# EasyEDA Pro project 4040M主控板V1.0.eprj

# Schematic 原理图
Board Name: ESP32s3; Create Date: 2025-05-14; Page Name: 电源; Project Name: 4040M主控板V1.0; Schematic Name: 原理图; Update Date: 2026-04-21; Company: 嘉立创EDA; Page Size: A3; Version: V1.0
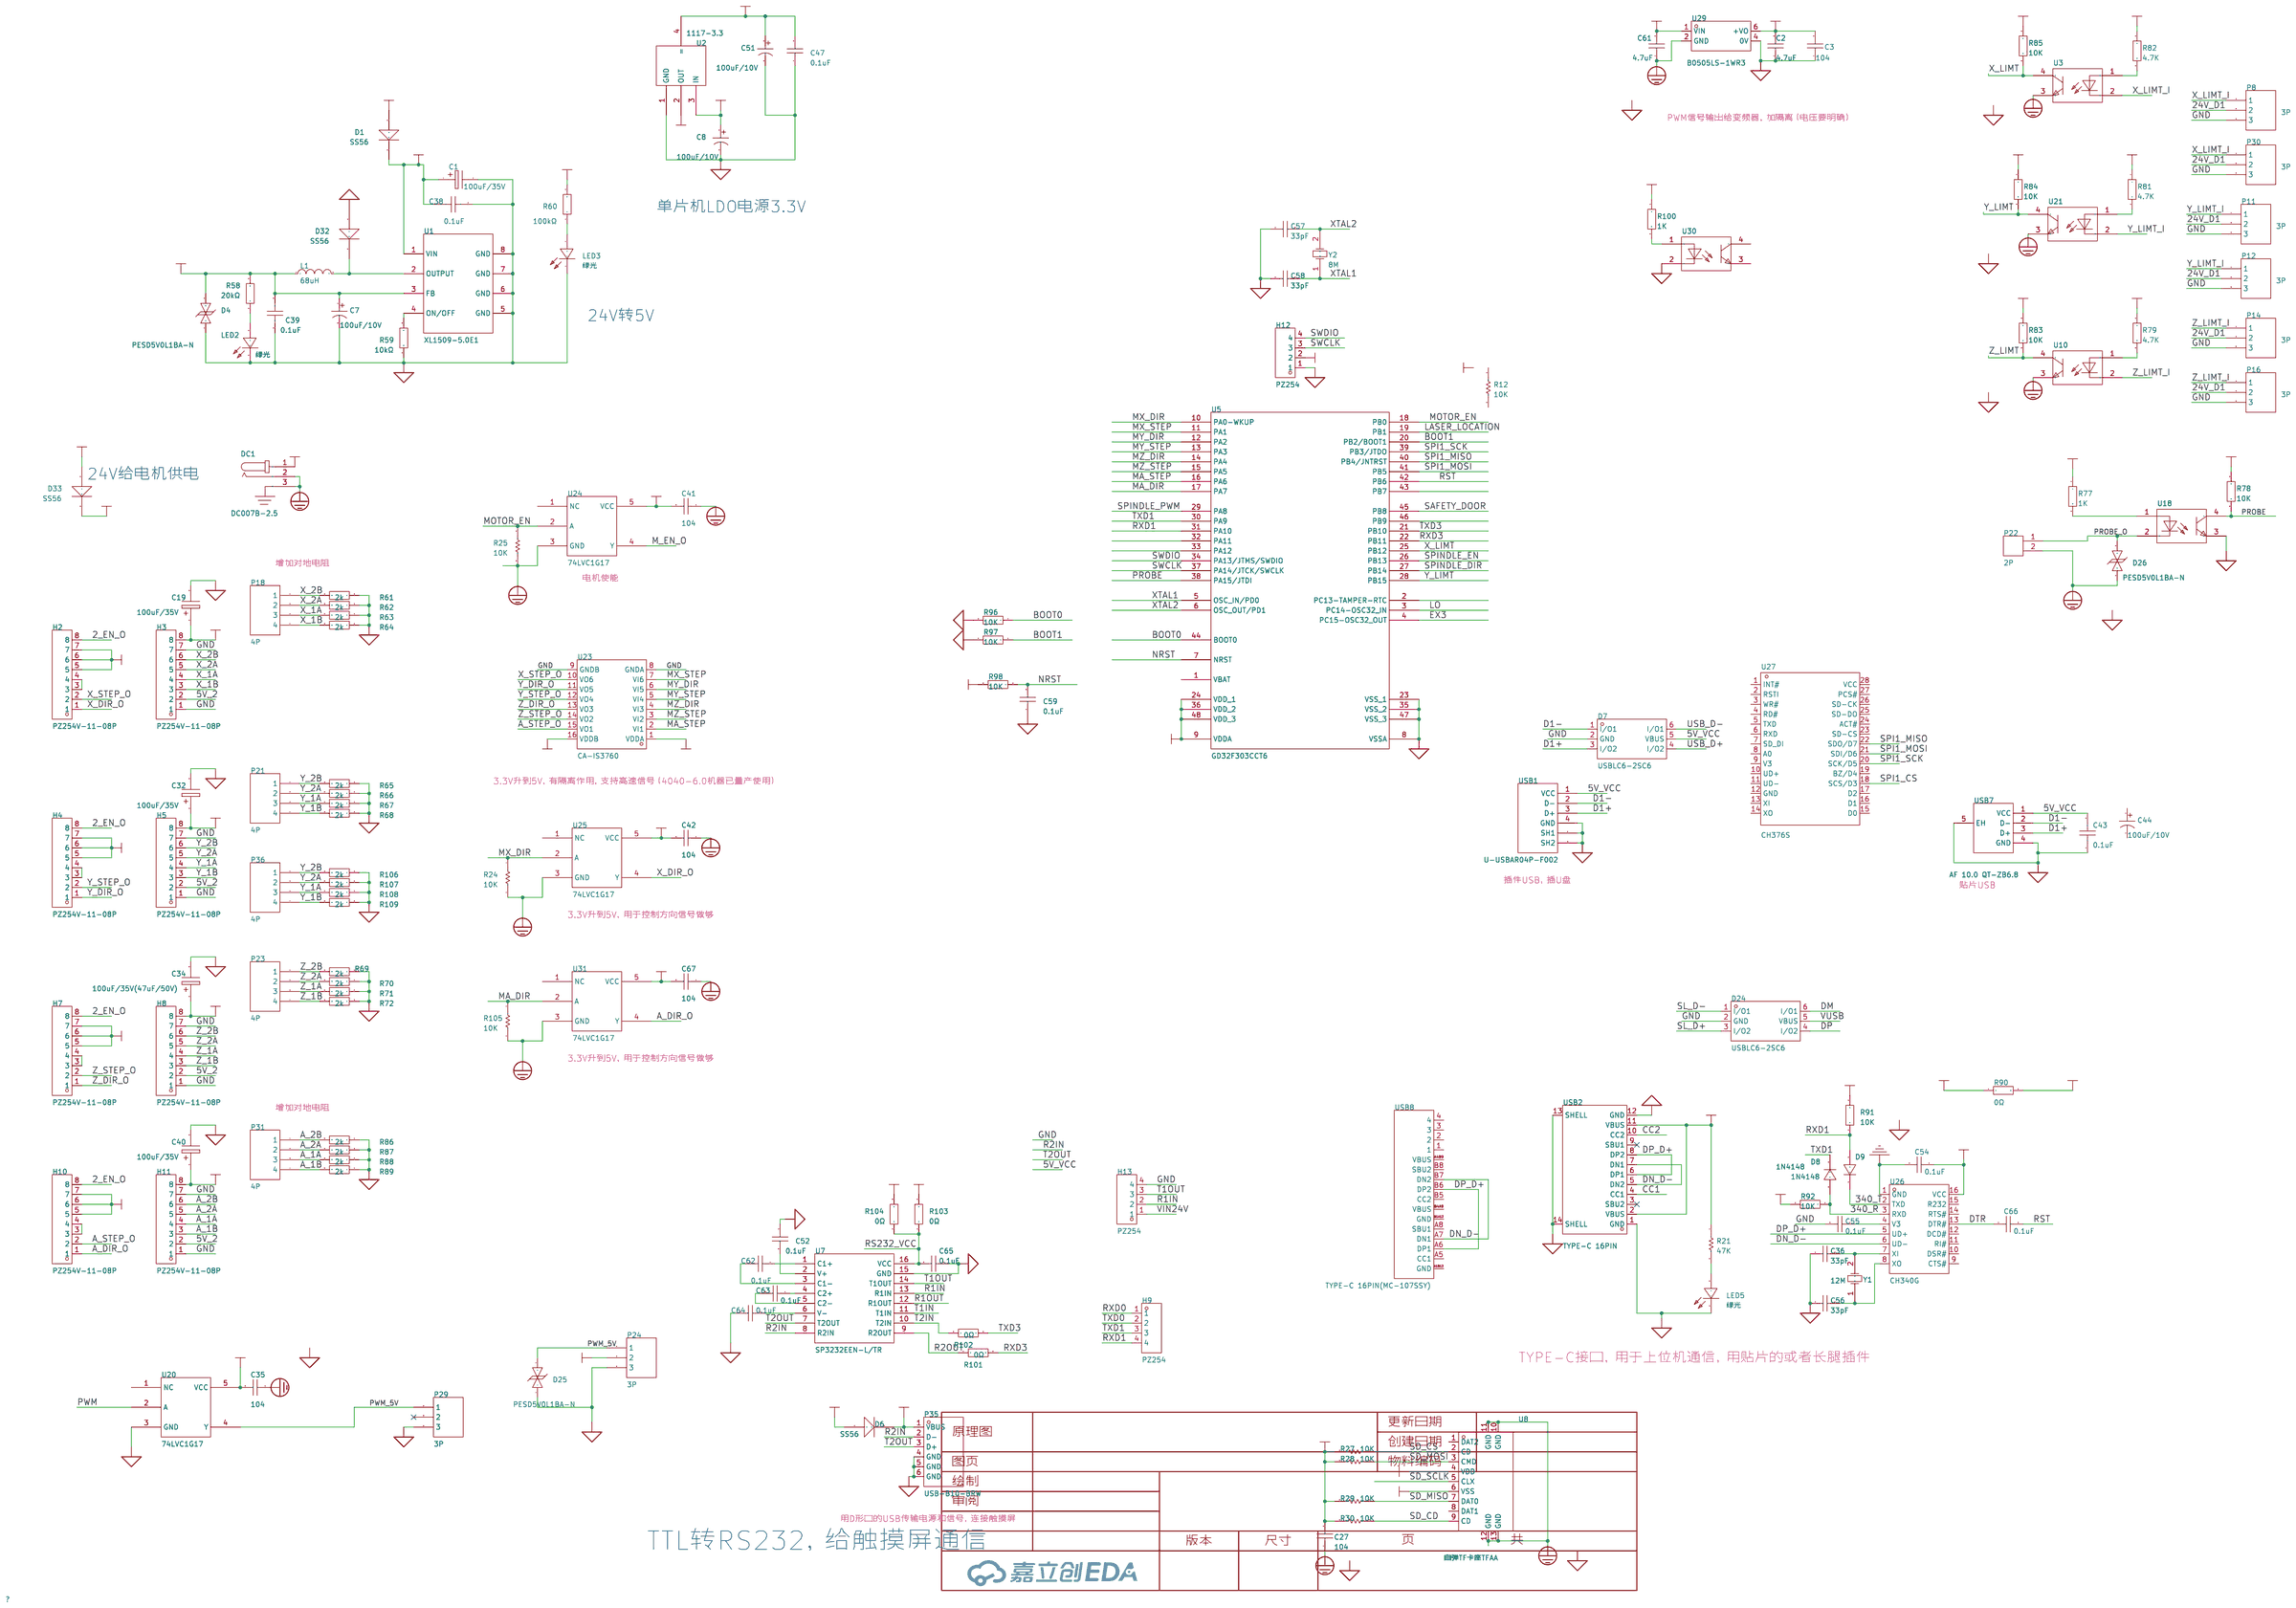
[diagram p0: schematic sheet]

## Parts
C1  100uF/35V  [电解电容贴片6X6]
C2  4.7uF  [C1206]
C3  104  [C0603]
C7  100uF/10V  [CAP-SMD_BD5.0-L5.3-W5.3-RD]
C8  100uF/10V  [CAP-SMD_BD5.0-L5.3-W5.3-RD]
C19  100uF/35V  [电解电容贴片6X6]
C27  104  [11]
C32  100uF/35V  [电解电容贴片6X6]
C34  100uF/35V(47uF/50V)  [电解电容贴片6X6]
C35  104  [0603C]
C36  33pF  [C0603]
C38  0.1uF  [C0603]
C39  0.1uF  [C0603]
C40  100uF/35V  [电解电容贴片6X6]
C41  104  [0603C]
C42  104  [0603C]
C43  0.1uF  [C0603]
C44  100uF/10V  [CAP-SMD_BD5.0-L5.3-W5.3-RD]
C47  0.1uF  [C0603]
C51  100uF/10V  [CAP-SMD_BD5.0-L5.3-W5.3-RD]
C52  0.1uF  [C0603]
C54  0.1uF  [C0603]
C55  0.1uF  [C0603]
C56  33pF  [C0603]
C57  33pF  [C0603]
C58  33pF  [C0603]
C59  0.1uF  [C0603]
C61  4.7uF  [C1206]
C62  0.1uF  [C0603]
C63  0.1uF  [C0603]
C64  0.1uF  [C0603]
C65  0.1uF  [C0603]
C66  0.1uF  [C0603]
C67  104  [0603C]
D1  SS56  [SMA]
D4  PESD5V0L1BA-N  [SOD-323_L1.8-W1.3-LS2.5-BI]
D6  SS56  [SMA]
D7  USBLC6-2SC6  [SOT-23-6_L2.9-W1.6-P0.95-LS2.8-BL]
D8  1N4148  [SOD-323_L1.8-W1.3-LS2.5-RD]
D9  1N4148  [SOD-323_L1.8-W1.3-LS2.5-RD]
D24  USBLC6-2SC6  [SOT-23-6_L2.9-W1.6-P0.95-LS2.8-BL]
D25  PESD5V0L1BA-N  [SOD-323_L1.8-W1.3-LS2.5-BI]
D26  PESD5V0L1BA-N  [SOD-323_L1.8-W1.3-LS2.5-BI]
D32  SS56  [SMA]
D33  SS56  [SMA]
DC1  DC007B-2.5  [DC-IN-TH_HX-DC007B-2.5]
H2  PZ254V-11-08P  [HDR-TH_8P-P2.54-V-M]
H3  PZ254V-11-08P  [HDR-TH_8P-P2.54-V-M]
H4  PZ254V-11-08P  [HDR-TH_8P-P2.54-V-M]
H5  PZ254V-11-08P  [HDR-TH_8P-P2.54-V-M]
H7  PZ254V-11-08P  [HDR-TH_8P-P2.54-V-M]
H8  PZ254V-11-08P  [HDR-TH_8P-P2.54-V-M]
H9  PZ254  [HDR-TH_4P-P2.54-V-M]
H10  PZ254V-11-08P  [HDR-TH_8P-P2.54-V-M]
H11  PZ254V-11-08P  [HDR-TH_8P-P2.54-V-M]
H12  PZ254  [HDR-TH_4P-P2.54-V-M]
H13  PZ254  [HDR-TH_4P-P2.54-V-M]
L1  68uH  [IND-SMD_L7.0-W7.0_SMDRI74-330MT]
LED2  绿光  [LED0603-RD]
LED3  绿光  [LED0603-RD]
LED5  绿光  [LED0603-RD]
P8  3P  [HDR1X3_CON]
P11  3P  [HDR1X3_CON]
P12  3P  [HDR1X3_CON]
P14  3P  [HDR1X3_CON]
P16  3P  [HDR1X3_CON]
P18  4P  [HDR1X4_CON]
P21  4P  [HDR1X4_CON]
P22  2P  [HDR1X2_CON]
P23  4P  [HDR1X4_CON]
P24  3P  [HDR1X3_CON]
P29  3P  [HDR1X3_CON]
P30  3P  [HDR1X3_CON]
P31  4P  [HDR1X4_CON]
P35  USB-B10-BRW  [USB-B-TH_USB-B10-BRW]
P36  4P  [HDR1X4_CON]
R12  10K  [0603R]
R21  47K  [10]
R24  10K  [0603R]
R25  10K  [0603R]
R27  10K  [10]
R28  10K  [10]
R29  10K  [10]
R30  10K  [10]
R58  20kΩ  [R0603]
R59  10kΩ  [R0603]
R60  100kΩ  [R0603]
R61  2k  [R0603]
R62  2k  [R0603]
R63  2k  [R0603]
R64  2k  [R0603]
R65  2k  [R0603]
R66  2k  [R0603]
R67  2k  [R0603]
R68  2k  [R0603]
R69  2k  [R0603]
R70  2k  [R0603]
R71  2k  [R0603]
R72  2k  [R0603]
R77  1K  [R0603]
R78  10K  [R0603]
R79  4.7K  [R0603]
R81  4.7K  [R0603]
R82  4.7K  [R0603]
R83  47K  [R0603]
R84  47K  [R0603]
R85  47K  [R0603]
R86  2k  [R0603]
R87  2k  [R0603]
R88  2k  [R0603]
R89  2k  [R0603]
R90  0Ω  [R0603]
R91  10K  [R0603]
R92  10K  [R0603]
R96  10K  [R0603]
R97  10K  [R0603]
R98  10K  [R0603]
R100  47K  [R0603]
R101  0Ω  [R0603]
R102  0Ω  [R0603]
R103  0Ω  [R0603]
R104  0Ω  [R0603]
R105  10K  [0603R]
R106  2k  [R0603]
R107  2k  [R0603]
R108  2k  [R0603]
R109  2k  [R0603]
U1  XL1509-5.0E1  [ESOP-8_L4.9-W3.9-P1.27-LS6.0-BL-EP]
U2  1117-3.3  [SOT-223]
U3  LTV-357T-C  [SOP-4_L4.4-W3.9-P2.54-LS7.0-TL]
U5  GD32F303CCT6  [LQFP48]
U7  SP3232EEN-L/TR  [SOIC-16_L9.9-W3.9-P1.27-LS6.0-BL]
U8  自弹TF卡座TFAA  [SIM-SMD_C9900015645]
U10  LTV-357T-C  [SOP-4_L4.4-W3.9-P2.54-LS7.0-TL]
U18  LTV-357T-C  [SOP-4_L4.4-W3.9-P2.54-LS7.0-TL]
U20  74LVC1G17  [SOT-23-5]
U21  LTV-357T-C  [SOP-4_L4.4-W3.9-P2.54-LS7.0-TL]
U23  CA-IS3760  [SOIC-16_L9.9-W3.9-P1.27-LS6.0-BL]
U24  74LVC1G17  [SOT-23-5]
U25  74LVC1G17  [SOT-23-5]
U26  CH340G  [SOIC-16_L9.9-W3.9-P1.27-LS6.0-BL]
U27  CH376S  [SOIC-28_L17.9-W7.5-P1.27-LS10.3-BL]
U29  B0505LS-1WR3  [PWRM-TH_BXXXXLS-1WR3]
U30  LTV-357T-C  [SOP-4_L4.4-W3.9-P2.54-LS7.0-TL]
U31  74LVC1G17  [SOT-23-5]
USB1  U-USBAR04P-F002  [USB-A-TH_USB-302-T]
USB2  TYPE-C 16PIN  [USB-C-SMD_TYPE-C-6PIN+]
USB7  AF 10.0 QT-ZB6.8  [USB-A-SMD_AF-10.0-QT-ZB6.8]
USB8  TYPE-C 16PIN(MC-107SSY)  [USB-TYPE-C-SMD_MC-107SSY]
Y1  12M  [晶振贴片49SSMD]
Y2  8M  [晶振贴片]

## Library data of the parts
C1 C19 C32 C34 C40 = 100uF/35V: Origin Footprint 2: X47U; Origin Footprint 1: 电解电容贴片6x6; Design Item ID: ELECTRO1; Library Name: *
C2 C3 C61 = 104: Design Item ID: CAP; Library Name: SCH--װ--
C7 C8 C44 C51 = CS1A101M-CRD54: 容值:100uF;精度:±20%;额定电压:10V;电容体直径:5mm;电容体长度:5.4mm;纹波电流:-;等效串联电阻:-;工作寿命:1000hrs@105℃;工作温度:-40℃~+105℃;; LCSC Part Name: 100uF ±20% 10V; Supplier Part: C96182; Manufacturer: ST(先科); Supplier Footprint: SMD,5x5.4mm; JLCPCB Part Class: Extended Part; Datasheet: https://atta.szlcsc.com/upload/public/pdf/source/20170304/1488621207726.pdf; Supplier: LCSC; Tolerance: ±20%; Rated Voltage: 10V; φD: 5mm; L: 5.4mm; Lifetime @ Temp: 1000hrs@105℃; Operating Temperature: -40℃~+105℃
C27 = 104: Capacitor (Semiconductor SIM Model); Published: 8-Jun-2000; LatestRevisionDate: 17-Jul-2002; LatestRevisionNote: Re-released for DXP Platform.; PackageReference: C1206; Publisher: Altium Limited; Origin Footprint 2: C1206; Origin Footprint 3: 0402; Origin Footprint 4: 1310[0504]; Origin Footprint 5: 1608[0603]; Origin Footprint 6: C1210; Origin Footprint 7: C0805; Origin Footprint 8: C1206; Origin Footprint 9: 0805; Origin Footprint 10: 0805L; Origin Footprint 11: 0805C; Origin Footprint 1: 0603C; Design Item ID: Cap Semi; Library Name: Miscellaneous Devices
C35 C41 C42 C67 = 104: Capacitor (Semiconductor SIM Model); Published: 8-Jun-2000; LatestRevisionDate: 17-Jul-2002; LatestRevisionNote: Re-released for DXP Platform.; PackageReference: C1206; Publisher: Altium Limited; Origin Footprint 2: C1206; Origin Footprint 3: 0402; Origin Footprint 4: 1310[0504]; Origin Footprint 5: 1608[0603]; Origin Footprint 6: C1210; Origin Footprint 7: C0805; Origin Footprint 8: C1206; Origin Footprint 9: 0805; Origin Footprint 10: 0805L; Design Item ID: Cap Semi; Library Name: Miscellaneous Devices
C36 C56-C58 = CL10C120JB8NNNC: LCSC Part Name: 12pF ±5% 50V; Supplier Part: C38523; Manufacturer: SAMSUNG(三星); Supplier Footprint: 0603; JLCPCB Part Class: 基础库; Datasheet: https://item.szlcsc.com/datasheet/CL10C120JB8NNNC/39506.html; Supplier: LCSC; Tolerance: ±5%; Voltage Rating: 50V; Temperature Coefficient: C0G
C38 C39 C43 = 0603B822K500NT: LCSC Part Name: 8.2nF ±10% 50V; Supplier Part: C1322360; Manufacturer: FH(风华); Supplier Footprint: 0603; JLCPCB Part Class: 基础库; Datasheet: https://item.szlcsc.com/datasheet/0603B822K500NT/1413077.html; Supplier: LCSC; Tolerance: ±10%; Voltage Rating: 50V; Temperature Coefficient: X7R
C47 C52 C54 C55 C59 C62-C66 = 0603B682K500NT: LCSC Part Name: 6.8nF ±10% 50V; Supplier Part: C1631; Manufacturer: FH(风华); Supplier Footprint: 0603; JLCPCB Part Class: 基础库; Datasheet: https://item.szlcsc.com/datasheet/0603B682K500NT/1983.html; Supplier: LCSC; Tolerance: ±10%; Voltage Rating: 50V; Temperature Coefficient: X7R
D1 D6 D32 D33 = SS56: Design Item ID: 1N4148; Library Name: SCH封装库
D4 D25 D26 = PESD5V0S1BBN: 极性:Bidirectional;反向关断电压（典型值）:5V (Max);击穿电压（最小值）:6V;箝位电压:15V;峰值脉冲电流（10/1000us）:5A (8/20us);; Supplier Part: C314264; Manufacturer: BORN伯恩半导体; Supplier Footprint: SOD-523; JLCPCB Part Class: Extended Part; Datasheet: https://atta.szlcsc.com/upload/public/pdf/source/20181015/C314264_F9AC5761AC2631DA841FBD1D9C6821E3.pdf; Supplier: LCSC; Polarity: Bidirectional; Voltage - Reverse Standoff (Typ): 5V (Max); Voltage - Breakdown (Min): 6V; Voltage - Clamping (Max) @ Ipp: 15V; Current - Peak Pulse (10/1000μs): 5A (8/20us)
D7 D24 = USBLC6-2SC6: 最大钳位电压:15V;击穿电压:6V;; Supplier Part: C2687116; Manufacturer: UMW(友台半导体); Supplier Footprint: SOT-23-6; JLCPCB Part Class: 扩展库; Datasheet: https://atta.szlcsc.com/upload/public/pdf/source/20231109/512642D850D9873E7C519F71E85B9A10.pdf; Supplier: LCSC; Maximum Clamping Voltage: 15V; Breakdown Voltage: 6V; Number of Lines: 双路; Type: ESD
D8 D9 = 1N4148WS_C2128: 二极管配置:独立式;正向压降(Vf):1.25V@150mA;直流反向耐压(Vr):100V;整流电流:150mA;反向恢复时间(Trr):4ns;; LCSC Part Name: 丝印T4 1N4148WS; Supplier Part: C2128; Manufacturer: CJ(江苏长电/长晶); Supplier Footprint: SOD-323; JLCPCB Part Class: 基础库; Datasheet: https://item.szlcsc.com/datasheet/1N4148WS/2485.html; Supplier: LCSC; Diode Configuration: 独立式; Voltage - Forward(Vf@If): 1.25V@150mA; Voltage - DC Reverse(Vr): 100V; Current - Rectified: 150mA; Pd - Power Dissipation: 200mW; Reverse Leakage Current (Ir): 1uA@75V; Reverse Recovery Time (trr): 4ns; Non-Repetitive Peak Forward Surge Current: 2A
DC1 = DC007B-2.5: 连接器类型:DC电源插座;安装方式:弯插;触点内径:2.5mm;触点外径:7.7mm;额定电流:5A;额定电压:20V;工作温度:-25℃~+70℃;; LCSC Part Name: DC电源插座 内径:2.5mm 外径:7.7mm; Supplier Part: C17701685; Manufacturer: SHOU HAN(首韩); Supplier Footprint: 插件; JLCPCB Part Class: 扩展库; Datasheet: https://atta.szlcsc.com/upload/public/pdf/source/20230912/B85EC3863CDA4EDD9FBFF38F4F2C356A.pdf; Supplier: LCSC; Connector Type: DC电源插座; Mounting Type: 弯插; Inside Contact Diameter: 2.5mm; Outside Contact Diameter: 7.7mm; Current Rating: 5A; Voltage Rating (Max): 20V; Operating Temperature: -25℃~+70℃
H2-H5 H7 H8 H10 H11 = PZ254V-11-08P: LCSC Part Name: 间距:2.54mm 1x8P 直插 方针; Supplier Part: C492407; Manufacturer: XFCN(兴飞); Supplier Footprint: 插件,P=2.54mm; JLCPCB Part Class: 扩展库; Datasheet: https://atta.szlcsc.com/upload/public/pdf/source/20200309/C492407_83A6FB26A2233368EDB9516968EC6149.pdf; Supplier: LCSC; Pin Structure: 1x8P; Pitch: 2.54mm; Circluar Pins/Square Pins: 方针; Mounting Type: 直插; Number of Rows: 单排; Number of Pins: 8P; Length of Mating Pin: 6mm; Insulation Height: 2.5mm; Length of End Connection Pin: 3mm; Contact Material: 黄铜; Operating Temperature Range: -40℃~+105℃; Color: 黑色
H9 H12 H13 = PZ254V-11-04P: LCSC Part Name: 1x4P 间距:2.54mm 方针 直插; Supplier Part: C2691448; Manufacturer: XFCN(兴飞); Supplier Footprint: 插件,P=2.54mm; JLCPCB Part Class: 扩展库; Datasheet: https://item.szlcsc.com/datasheet/PZ254V-11-04P/2801085.html; Supplier: LCSC; Pin Structure: 1x4P; Pitch: 2.54mm; Circluar Pins/Square Pins: 方针; Mounting Type: 直插; Number of Rows: 单排; Number of Pins: 4P; Current Rating: 3A; Voltage Rating (Max): 250V; Length of Mating Pin: 6mm; Insulation Height: 2.5mm; Length of End Connection Pin: 3mm; Operating Temperature: -40℃~+105℃; Color: 黑色
L1 = SMDRI74-330MT: 电感值:33uH;精度:±20%;额定电流:960mA;饱和电流(Isat):1.8A;类型:屏蔽电感;; LCSC Part Name: 33uH±20%1.8A; Supplier Part: C49625; Manufacturer: SXN(顺翔诺); Supplier Footprint: SMD,7.5x7.5mm; JLCPCB Part Class: 扩展库; Datasheet: https://atta.szlcsc.com/upload/public/pdf/source/20210810/6F96FDC19AA308DD2AD166FFB9640E87.pdf; Supplier: LCSC; Tolerance: ±20%; Rated Current: 960mA; Saturation Current (Isat): 1.8A; DC Resistance (DCR): 170mΩ; Type: 屏蔽电感
LED2 LED3 LED5 = KT-0603R: LCSC Part Name: 0603 红灯 高亮; Supplier Part: C2286; Manufacturer: KENTO; Supplier Footprint: 0603; JLCPCB Part Class: 基础库; Datasheet: https://item.szlcsc.com/datasheet/KT-0603R/2659.html; Supplier: LCSC; Illumination Color: 红色; Voltage - Forward(Vf): 1.8V~2.4V; Power(Watts): 40mW; Forward Current: 20mA; Wavelength - Dominant: 615nm~630nm; Peak Wavelength: 645nm; Diode Configuration: 独立二极管; Lens Color: 无色透明透镜; Luminous Intensity: 300mcd; Viewing Angle: 120°; Operating Temperature: -40℃~+85℃
P8 P11 P12 P14 P16 P24 P29 P30 = 3P: Library Name: SCH封装库
P18 P21 P23 P31 P36 = 4P: Library Name: SCH封装库
P22 = 2P: Library Name: SCH--װ--
P35 = USB-B10-BRW: 连接器类型:Type-B;标准:USB 2.0;公母:母;端口数量:1;触点数量:4P;安装方式:弯插;额定电流 - 电源:1.5A;工作温度范围:-20℃~+70℃;焊接温度(最大值):260℃;; LCSC Part Name: Type-B母弯插; Supplier Part: C720549; Manufacturer: XUNPU(讯普); Supplier Footprint: 插件; JLCPCB Part Class: 扩展库; Datasheet: https://atta.szlcsc.com/upload/public/pdf/source/20200812/C720549_53E9294752E2933874870440E626C579.pdf; Supplier: LCSC; Connector Type: Type-B; Standard: USB2.0; Gender: 母; Number of Ports: 1; Number of Contacts: 4P; Mounting Style: 弯插; Current Rating - Power (Max): 1.5A; Operating Temperature Range: -20℃~+70℃; Soldering Temperature(Max): 260℃
R12 = 10k: Resistor; Published: 8-Jun-2000; LatestRevisionDate: 17-Jul-2002; LatestRevisionNote: Re-released for DXP Platform.; PackageReference: AXIAL-0.3; Publisher: Altium Limited; Origin Footprint 2: AXIAL-0.3; Origin Footprint 3: R0805; Origin Footprint 4: 0805R; Design Item ID: RES; Library Name: SCH封装库
R21 R27-R30 = 10K: Resistor; Published: 8-Jun-2000; LatestRevisionDate: 17-Jul-2002; LatestRevisionNote: Re-released for DXP Platform.; PackageReference: AXIAL-0.3; Publisher: Altium Limited; Origin Footprint 2: AXIAL-0.3; Origin Footprint 3: R0805; Origin Footprint 4: 0805R; Origin Footprint 1: 0603R; Design Item ID: RES; Library Name: SCH封装库
R24 R25 R105 = 10K: Resistor; Published: 8-Jun-2000; LatestRevisionDate: 17-Jul-2002; LatestRevisionNote: Re-released for DXP Platform.; PackageReference: AXIAL-0.3; Publisher: Altium Limited; Origin Footprint 2: AXIAL-0.3; Origin Footprint 3: R0805; Origin Footprint 4: 0805R; Design Item ID: RES; Library Name: SCH--װ--
R58-R72 R77-R79 R81-R92 R96-R98 R100-R104 R106-R109 = 0603WAF2402T5E: LCSC Part Name: 24kΩ ±1% 100mW 厚膜电阻; Supplier Part: C23352; Manufacturer: UNI-ROYAL(厚声); Supplier Footprint: 0603; JLCPCB Part Class: 基础库; Datasheet: https://item.szlcsc.com/datasheet/0603WAF2402T5E/24085.html; Supplier: LCSC; Type: 厚膜电阻; Tolerance: ±1%; Power(Watts): 100mW; Voltage-Supply(Max): 75V; Temperature Coefficient: ±100ppm/℃; Operating Temperature: -55℃~+155℃
U1 = XL1509-5.0E1: 功能类型:降压型;同步整流:-;输出通道数:-;拓扑结构:-;输入电压:-;输出电流(最大值):-;开关频率:-;; LCSC Part Name: 降压型; Supplier Part: C61063; Manufacturer: XLSEMI(芯龙); Supplier Footprint: SOP-8_150mil; JLCPCB Part Class: Basic Part; Datasheet: https://atta.szlcsc.com/upload/public/pdf/source/20151020/1457707483545.pdf; Supplier: LCSC; Function: 降压型
U2 = 1117-3.3: Design Item ID: LM1117; Library Name: Party600
U3 U10 U18 U21 U30 = LTV-357T-C: 输入电压类型:DC;正向电压:1.2V;输出电流:50mA;隔离电压(rms):3.75kV;反向电压:6V;接收端电压:35V;输出通道数:1;集射极饱和电压(Vce(sat)@Ic,IF):200mV@1mA,20mA;; Supplier: LCSC; Manufacturer: LITEON(光宝); Supplier Part: C119091; JLCPCB Part Class: 扩展库; LCSC Part Name: DC输入隔离电压(rms):3750V; Supplier Footprint: SOP-4-2.54mm; Datasheet: https://atta.szlcsc.com/upload/public/pdf/source/20170930/C133128_1506736380934997376.pdf; Input voltage type: DC; Output Type: 光电三极管; Forward Voltage: 1.2V; Output Current: 50mA; Isolation Voltage(rms): 3.75kV; Reverse Voltage: 6V; Receiving End Voltage: 35V; Number of Outputs: 1; Collector-Emitter Saturation Voltage (Vce(sat)@Ic,IF): 200mV@1mA,20mA; Rise time: 4us@2mA,100Ω; Fall time: 3us@2mA,100Ω; Operating Temperature: -55℃~+110℃
U5 = STM32F103C8T6/CBT6: STM32 ARM-based 32-bit MCU with 32 Kbytes Flash, 48-pin LQFP, Industrial Temperature; Published: *; DatasheetVersion: *; PackageVersion: *; PackageReference: *; Publisher: *; PackageDescription: *; ComponentLink1Description: *; ComponentLink1URL: *; ComponentLink2Description: *; ComponentLink2URL: *; Origin Footprint 2: LQFP48_L; Origin Footprint 3: LQFP48_M; Design Item ID: STM32F103C6T6; Library Name: ST Microcontroller 32-Bit STM32 SCH
U7 = SP3232EEN-L/TR: LCSC Part Name: True3.0V至5.5V RS-232收发器; Supplier Part: C9378; Manufacturer: MaxLinear(迈凌); Supplier Footprint: SOIC-16; JLCPCB Part Class: 扩展库; Datasheet: https://item.szlcsc.com/datasheet/SP3232EEN-L%252FTR/9907.html; Supplier: LCSC; Type: 收发器; Number of Drivers: 2; Number of Receivers: 2; Data Rate: 235Kbps; Voltage - Supply: 3V~5.5V; Operating Temperature: -40℃~+85℃
U8 = 自弹TF卡座TFAA: Supplier Part: C9900015645; Supplier Footprint: SMD; JLCPCB Part Class: 扩展库; Supplier: LCSC
U20 U24 U25 U31 = 74LVC1G04: Library Name: SCH--װ--
U23 = CA-IS3760HN: LCSC Part Name: CA‐IS376x 高速六通道数字隔离器; Supplier Part: C19723481; Manufacturer: Chipanalog(川土微); Supplier Footprint: SOIC-16-NB; JLCPCB Part Class: 扩展库; Datasheet: https://atta.szlcsc.com/upload/public/pdf/source/20231222/0EEB57886E3672BACB4CFC71CD69856C.pdf; Supplier: LCSC
U26 = CH340G: 应用功能:收发器;接口协议:USB 2.0;数据速率:2Mbps;; LCSC Part Name: USB转串口芯片 CH340; Supplier Part: C14267; Manufacturer: WCH(南京沁恒); Supplier Footprint: SOP-16; JLCPCB Part Class: 扩展库; Datasheet: https://atta.szlcsc.com/upload/public/pdf/source/20230530/6E401E9554E9F5311886CC8B3F89B62E.pdf; Supplier: LCSC; Applications Function: 收发器; Protocol: USB 2.0; Supply Voltage: 3.3V；5V; Data Rate: 2Mbps
U27 = CH376S: LCSC Part Name: USB闪存盘和SD卡文件管理控制芯片; Supplier Part: C14166; Manufacturer: WCH(南京沁恒); Supplier Footprint: SOP-28-300mil; JLCPCB Part Class: 扩展库; Datasheet: https://item.szlcsc.com/datasheet/CH376S/14823.html; Supplier: LCSC; USB Protocol: USB 2.0; Voltage - Supply: 3.3V；5V; Data Rate: 12Mbps
U29 = B0505LS-1WR3: 100%国产化器件，高可靠性，具备ROHS、REACH、CE认证产品; Supplier Part: C909800; Manufacturer: DEXU(德旭电子); Supplier Footprint: 插件; JLCPCB Part Class: 扩展库; Datasheet: https://atta.szlcsc.com/upload/public/pdf/source/20220506/97E51FF679E86FC18F266BBBBBA200F9.pdf; Supplier: LCSC; Number of channel: 1; input voltage (Vdc): 4.5V~5.5V; Output Voltage: 5V; Output Current (Max): 200mA
USB1 = U-USBAR04P-F002: 连接器类型:Type-A;协议标准:USB 2.0;公母:母;安装方式:弯插;触点数量:4P;端口数量:1;额定电流 - 电源:1.5A;工作温度:0℃~+50℃;; LCSC Part Name: USB母座; Supplier Part: C386736; Manufacturer: Ckmtw(灿科盟); Supplier Footprint: 弯插; JLCPCB Part Class: 扩展库; Datasheet: https://item.szlcsc.com/datasheet/U-USBAR04P-F002/360843.html; Supplier: LCSC; Connector Type: Type-A; Protocol Standard: USB 2.0; Gender: 母; Mounting Type: 弯插; Number of Contacts: 4P; Number of Ports: 1; Current Rating-Power: 1.5A; Voltage Rating: 30V; Length: 14mm; Detection color: 白色; Operating Temperature: 0℃~+50℃
USB2 = TYPE-C 16PIN 2MD(073): 连接器类型:Type-C;标准:-;公母:母;端口数量:1;触点数量:16P;安装方式:卧贴;额定电流 - 电源:5A;工作温度范围:-25℃~+85℃;; LCSC Part Name: Type-C 母 卧贴; Supplier Part: C2765186; Manufacturer: SHOU HAN(首韩); Supplier Footprint: SMD; JLCPCB Part Class: Extended Part; Datasheet: https://atta.szlcsc.com/upload/public/pdf/source/20211123/39B17C16241EAC15C5E277BDA434118E.pdf; Supplier: LCSC; Connector Type: Type-C; Gender: 母; Number of Ports: 1; Number of Contacts: 16P; Mounting Style: 卧贴; Current Rating - Power (Max): 5A; Operating Temperature Range: -25℃~+85℃
USB7 = AF 10.0 QT-ZB6.8: 连接器类型:Type-A;协议标准:USB 2.0;公母:母;安装方式:卧贴;触点数量:4P;端口数量:1;额定电流 - 电源:1.5A;工作温度:-25℃~+85℃;; LCSC Part Name: Type-A 母 卧贴; Supplier Part: C456016; Manufacturer: SHOU HAN(首韩); Supplier Footprint: SMD; Datasheet: https://item.szlcsc.com/datasheet/AF%252010.0%2520QT-ZB6.8/458823.html; Supplier: LCSC; Connector Type: Type-A; Protocol Standard: USB 2.0; Gender: 母; Mounting Type: 卧贴; Number of Contacts: 4P; Number of Ports: 1; Current Rating-Power: 1.5A; Voltage Rating: 30V; Connect-Disconnect Life: 5千次; Length: 10mm; Detection color: 黑色; Operating Temperature: -25℃~+85℃
USB8 = MC-107SSY: LCSC Part Name: Type-C 母 卧贴; Supplier Part: C3039307; Manufacturer: HANBO(汉博); Supplier Footprint: SMD; JLCPCB Part Class: 扩展库; Datasheet: https://item.szlcsc.com/datasheet/MC-107SSY/3592983.html; Supplier: LCSC; Connector Type: Type-C; Protocol Standard: USB 3.1; Gender: 母; Mounting Type: 卧贴; Number of Contacts: 16P; Number of Ports: 1; Current Rating-Power: 5A; Voltage Rating: 5V; Connect-Disconnect Life: 1万次; Operating Temperature: -25℃~+85℃
Y1 = 12M: Crystal Oscillator; Published: 8-Jun-2000; LatestRevisionDate: 17-Jul-2002; LatestRevisionNote: Re-released for DXP Platform.; PackageReference: R38; Publisher: Altium Limited; Origin Footprint 2: R38; Origin Footprint 3: XTAL-49S; Design Item ID: XTAL; Library Name: Miscellaneous Devices
Y2 = 8M: Crystal Oscillator; Published: 8-Jun-2000; LatestRevisionDate: 17-Jul-2002; LatestRevisionNote: Re-released for DXP Platform.; PackageReference: R38; Publisher: Altium Limited; Origin Footprint 2: R38; Origin Footprint 3: XTAL-49S; Design Item ID: XTAL; Library Name: Miscellaneous Devices

## Nets
3V3: C27.2 C47.2 C51.1 H12.2 R27.2 R28.2 R29.2 R30.2 R78.1 R83.1 R84.1 R85.1 R91.2 R98.2 R100.1 R104.2 U2.2(OUT) U2.4(=) U5.9(VDDA) U5.24(VDD_1) U5.36(VDD_2) U5.48(VDD_3) U8.4(VDD) U23.1(VDDA)
5V_2: H2.5 H2.6 H2.7 H3.2 H4.5 H4.6 H4.7 H5.2 H7.5 H7.6 H7.7 H8.2 H10.5 H10.6 H10.7 H11.2
5V_MCU: C2.2 C3.2 U29.6(+VO)
5V_USB: R21.1 R90.1 USB2.2(VBUS) USB2.11(VBUS)
5V_VCC: C7.1 C8.1 C35.2 C39.2 C41.2 C42.2 C43.2 C54.1 C61.2 C67.2 D4.2 D7.5(VBUS) L1.1 R58.2 R77.1 R90.2 R92.2 R103.2 U1.3(FB) U2.3(IN) U20.5(VCC) U23.16(VDDB) U24.5(VCC) U25.5(VCC) U26.16(VCC) U29.1(VIN) U31.5(VCC) USB1.1(VCC) USB7.1(VCC)
24V_D1: C1.1 C38.1 D1.2 P8.2 P11.2 P12.2 P14.2 P16.2 P24.2 P30.2 R60.2 R79.1 R81.1 R82.1 U1.1(VIN)
24V_D2: C19.1 C32.1 C34.1 C40.1 D33.2 H3.8 H5.8 H8.8 H11.8
24V_OUT: D6.2 P35.1(VBUS)
GND: C1.2 C7.2 C8.2 C19.2 C27.1 C32.2 C34.2 C35.1 C36.1 C38.2 C39.1 C40.2 C41.1 C42.1 C43.1 C47.1 C51.2 C52.1 C54.2 C55.2 C56.1 C57.1 C58.1 C59.1 C64.2 C65.1 C67.1 D4.1 D7.2(GND) D24.2(GND) D25.1 D26.1 D32.1 DC1.2 DC1.3 H3.1 H3.7 H5.1 H5.7 H8.1 H8.7 H11.1 H11.7 H12.1 H13.4 LED2.1(K) LED3.1(K) LED5.1(K) P8.3 P11.3 P12.3 P14.3 P16.3 P22.2 P24.3 P29.3 P30.3 P35.4(GND) P35.5(GND) P35.6(GND) R24.2 R25.2 R59.1 R61.1 R62.1 R63.1 R64.1 R65.1 R66.1 R67.1 R68.1 R69.1 R70.1 R71.1 R72.1 R86.1 R87.1 R88.1 R89.1 R96.2 R97.2 R105.2 R106.1 R107.1 R108.1 R109.1 U1.5(GND) U1.6(GND) U1.7(GND) U1.8(GND) U2.1(GND) U3.3 U5.8(VSSA) U5.23(VSS_1) U5.35(VSS_2) U5.47(VSS_3) U7.15(GND) U8.6(VSS) U8.10(GND) U8.11(GND) U8.12(GND) U8.13(GND) U10.3 U18.3 U20.3(GND) U21.3 U23.8(GNDA) U23.9(GNDB) U24.3(GND) U25.3(GND) U26.1(GND) U30.2 U31.3(GND) USB1.4(GND) USB1.5(SH1) USB1.6(SH2) USB2.1(GND) USB2.12(GND) USB2.13(SHELL) USB2.14(SHELL) USB7.4(GND) USB7.5(EH)
PGND: C61.1 U29.2(GND)
SGND: C2.1 C3.1 U29.4(0V)
VIN24V: D1.1 D6.1 D33.1 DC1.1 H13.1
2_EN_O: H2.8 H4.8 H7.8 H10.8
340_R: D8.2(A) R92.1 U26.3(RXD)
340_T: D9.1(K) U26.2(TXD)
A_1A: H11.4 P31.3 R88.2
A_1B: H11.3 P31.4 R89.2
A_2A: H11.5 P31.2 R87.2
A_2B: H11.6 P31.1 R86.2
A_DIR_O: H10.1 U31.4(Y)
A_STEP_O: H10.2 U23.15(VO1)
BOOT0: R96.1 U5.44(BOOT0)
BOOT1: R97.1 U5.20(PB2/BOOT1)
CC1: USB2.4(CC1)
CC2: USB2.10(CC2)
D1+: D7.3(I/O2) USB1.3(D+) USB7.3(D+)
D1-: D7.1(I/O1) USB1.2(D-) USB7.2(D-)
DM: D24.6(I/O1)
DN_D-: U26.6(UD-) USB2.5(DN2) USB2.7(DN1) USB8.A7(DN1) USB8.B7(DN2)
DP: D24.4(I/O2)
DP_D+: U26.5(UD+) USB2.6(DP1) USB2.8(DP2) USB8.A6(DP1) USB8.B6(DP2)
DTR: C66.2 U26.13(DTR#)
EX3: U5.4(PC15-OSC32_OUT)
LASER_LOCATION: U5.19(PB1)
LO: U5.3(PC14-OSC32_IN)
M_EN_O: U24.4(Y)
MA_DIR: R105.1 U5.17(PA7) U31.2(A)
MA_STEP: U5.16(PA6) U23.2(VI1)
MOTOR_EN: R25.1 U5.18(PB0) U24.2(A)
MX_DIR: R24.1 U5.10(PA0-WKUP) U25.2(A)
MX_STEP: U5.11(PA1) U23.7(VI6)
MY_DIR: U5.12(PA2) U23.6(VI5)
MY_STEP: U5.13(PA3) U23.5(VI4)
MZ_DIR: U5.14(PA4) U23.4(VI3)
MZ_STEP: U5.15(PA5) U23.3(VI2)
NRST: C59.2 R98.1 U5.7(NRST)
PROBE: R78.2 U5.38(PA15/JTDI) U18.4
PROBE_O: D26.2 P22.1 U18.2
PWM: U20.2(A)
PWM_5V: D25.2 P24.1 P29.1 U20.4(Y)
R1IN: H13.2 U7.13(R1IN)
R1OUT: U7.12(R1OUT)
R2IN: P35.2(D-) U7.8(R2IN)
R2OUT: R101.1 U7.9(R2OUT)
RS232_VCC: C65.2 R103.1 R104.1 U7.16(VCC)
RST: C66.1 U5.42(PB6)
RXD0: H9.1
RXD1: D9.2(A) H9.4 R91.1 U5.31(PA10)
RXD3: R101.2 U5.22(PB11)
SAFETY_DOOR: U5.45(PB8)
SD_CD: R30.1 U8.9(CD)
SD_CS: R27.1 U8.2(CD)
SD_MISO: R29.1 U8.7(DAT0)
SD_MOSI: R28.1 U8.3(CMD)
SD_SCLK: U8.5(CLX)
SL_D+: D24.3(I/O2)
SL_D-: D24.1(I/O1)
SPI1_CS: U27.18(SCS/D3)
SPI1_MISO: U5.40(PB4/JNTRST) U27.22(SDO/D7)
SPI1_MOSI: U5.41(PB5) U27.21(SDI/D6)
SPI1_SCK: U5.39(PB3/JTDO) U27.20(SCK/D5)
SPINDLE_DIR: U5.27(PB14)
SPINDLE_EN: U5.26(PB13)
SPINDLE_PWM: U5.29(PA8)
SWCLK: H12.3 U5.37(PA14/JTCK/SWCLK)
SWDIO: H12.4 U5.34(PA13/JTMS/SWDIO)
T1IN: U7.11(T1IN)
T1OUT: H13.3 U7.14(T1OUT)
T2IN: R102.1 U7.10(T2IN)
T2OUT: P35.3(D+) U7.7(T2OUT)
TXD0: H9.2
TXD1: D8.1(K) H9.3 U5.30(PA9)
TXD3: R102.2 U5.21(PB10)
USB_D+: D7.4(I/O2)
USB_D-: D7.6(I/O1)
VUSB: D24.5(VBUS)
X_1A: H3.4 P18.3 R63.2
X_1B: H3.3 P18.4 R64.2
X_2A: H3.5 P18.2 R62.2
X_2B: H3.6 P18.1 R61.2
X_DIR_O: H2.1 U25.4(Y)
X_LIMT: R85.2 U3.4 U5.25(PB12)
X_LIMT_I: P8.1 P30.1 U3.2
X_STEP_O: H2.2 U23.10(VO6)
XTAL1: C58.2 U5.5(OSC_IN/PD0) Y2.1(OSC1)
XTAL2: C57.2 U5.6(OSC_OUT/PD1) Y2.2(OSC2)
Y_1A: H5.4 P21.3 P36.3 R67.2 R108.2
Y_1B: H5.3 P21.4 P36.4 R68.2 R109.2
Y_2A: H5.5 P21.2 P36.2 R66.2 R107.2
Y_2B: H5.6 P21.1 P36.1 R65.2 R106.2
Y_DIR_O: H4.1 U23.11(VO5)
Y_LIMT: R84.2 U5.28(PB15) U21.4
Y_LIMT_I: P11.1 P12.1 U21.2
Y_STEP_O: H4.2 U23.12(VO4)
Z_1A: H8.4 P23.3 R71.2
Z_1B: H8.3 P23.4 R72.2
Z_2A: H8.5 P23.2 R70.2
Z_2B: H8.6 P23.1 R69.2
Z_DIR_O: H7.1 U23.13(VO3)
Z_LIMT: R83.2 U10.4
Z_LIMT_I: P14.1 P16.1 U10.2
Z_STEP_O: H7.2 U23.14(VO2)
$9N177844: H2.3 H2.4
$9N190158: H4.3 H4.4
$9N190589: H7.3 H7.4
$9N274640: D32.2 L1.2 U1.2(OUTPUT)
$9N274642: R59.2 U1.4(ON/OFF)
$9N275850: C55.1 U26.4(V3)
$9N276822: C64.1 U7.6(V-)
$9N276825: C52.2 U7.2(V+)
$9N276826: C63.1 U7.4(C2+)
$9N276827: C63.2 U7.5(C2-)
$9N276828: C62.1 U7.1(C1+)
$9N276829: C62.2 U7.3(C1-)
$9N307221: R82.2 U3.1
$9N307261: R81.2 U21.1
$9N307269: R79.2 U10.1
$9N307549: R77.2 U18.1
$9N311576: LED2.2(A) R58.1
$9N311623: LED3.2(A) R60.1
$9N316563: H10.3 H10.4
$9N325429: LED5.2(A) R21.2
$9N325604: C36.2 U26.7(XI) Y1.2(OSC2)
$9N325608: C56.2 U26.8(XO) Y1.1(OSC1)
$9N336111: R100.2 U30.1

Not connected (* = marked no-connect by the designer): C44 1 2; P29 2*; R12 1 2; U5 1(VBAT) 2(PC13-TAMPER-RTC) 32(PA11) 33(PA12) 43(PB7) 46(PB9); U8 1(DAT2) 8(DAT1); U20 1(NC); U24 1(NC); U25 1(NC); U26 9(CTS#) 10(DSR#) 11(RI#) 12(DCD#) 14(RTS#) 15(R232); U27 1(INT#) 2(RSTI) 3(WR#) 4(RD#) 5(TXD) 6(RXD) 7(SD_DI) 8(A0) 9(V3) 10(UD+) 11(UD-) 12(GND) 13(XI) 14(XO) 15(D0) 16(D1) 17(D2) 19(BZ/D4) 23(SD-CS) 24(ACT#) 25(SD-DO) 26(SD-CK) 27(PCS#) 28(VCC); U30 3 4; U31 1(NC); USB2 3(SBU2)* 9(SBU1)*; USB8 1 2 3 4 A1B12(GND) A4B9(VBUS) A5(CC1) A8(SBU1) B1A12(GND) B4A9(VBUS) B5(CC2) B8(SBU2)

## Notes on the sheet
- PWM信号输出给变频器，加隔离（电压要明确）
- 单片机LDO电源3.3V
- 24V转5V
- 24V给电机供电
- 增加对地电阻
- 电机使能
- 3.3V升到5V，有隔离作用，支持高速信号（4040-6.0机器已量产使用）
- 插件USB，插U盘
- 贴片USB
- 3.3V升到5V，用于控制方向信号做够
- 3.3V升到5V，用于控制方向信号做够
- 增加对地电阻
- TYPE-C接口，用于上位机通信，用贴片的或者长腿插件
- 用D形口的USB传输电源和信号，连接触摸屏
- TTL转RS232，给触摸屏通信

# Board PCB
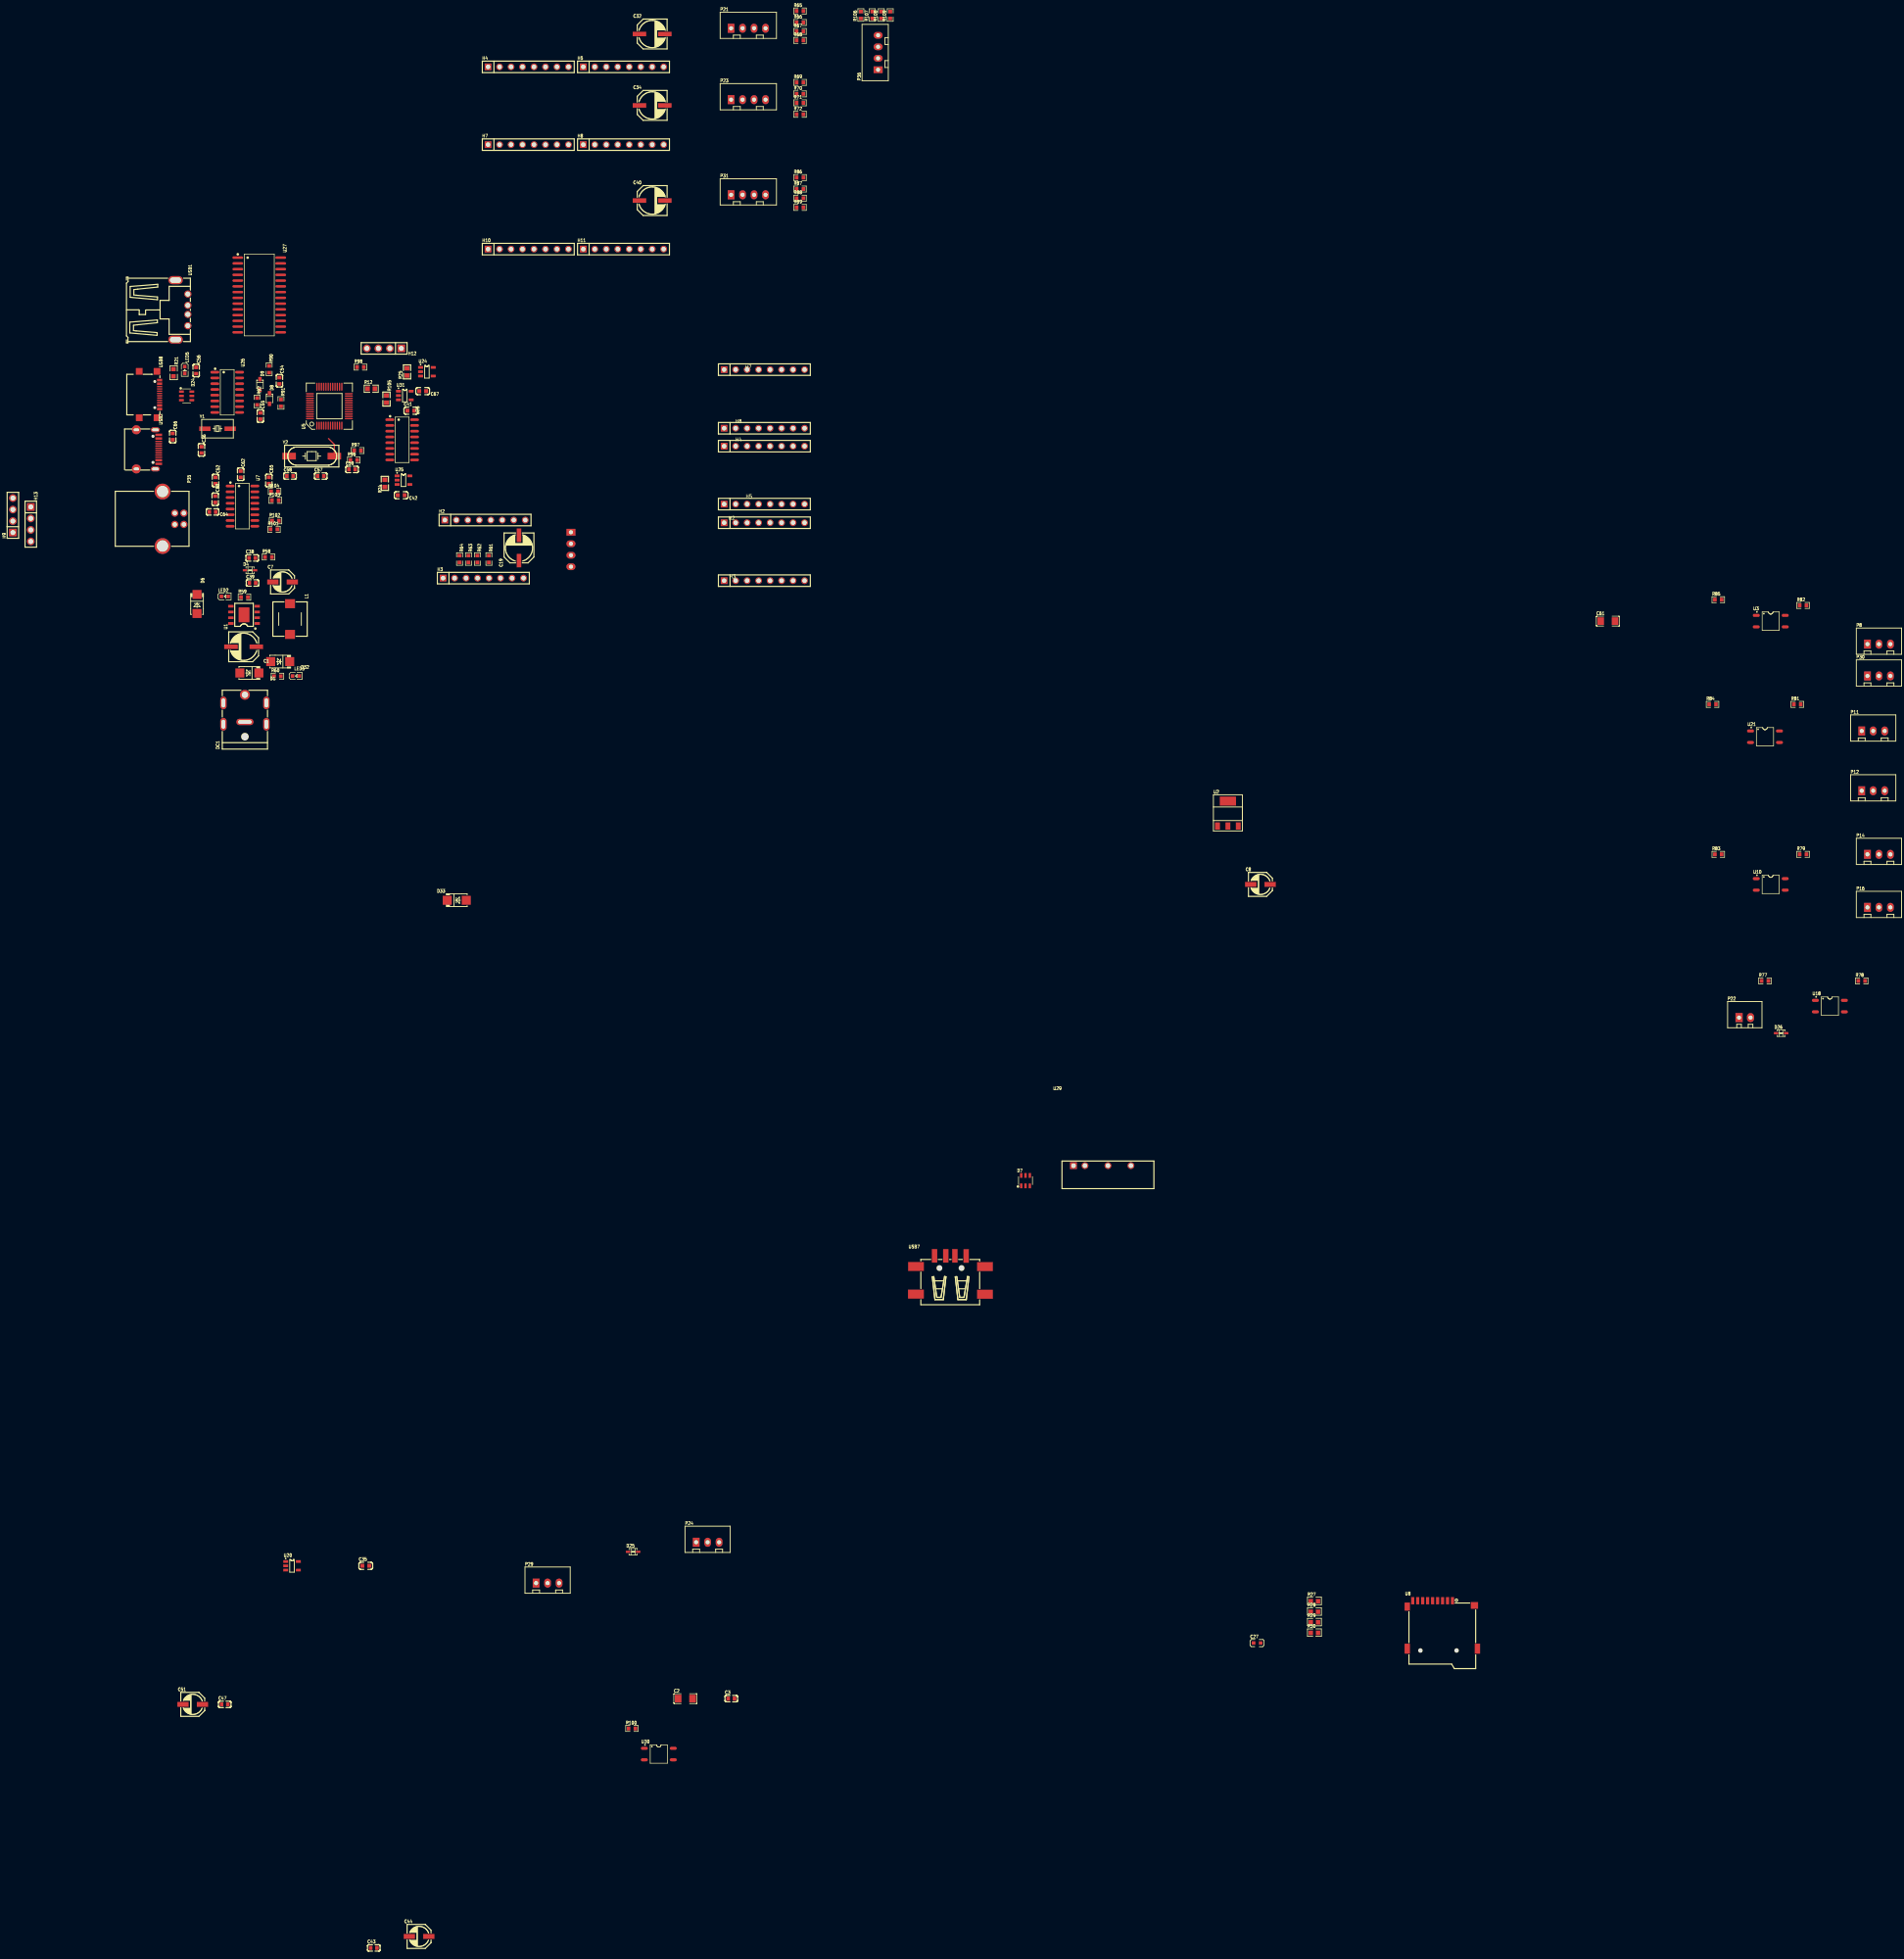
[diagram p1: board, top side]
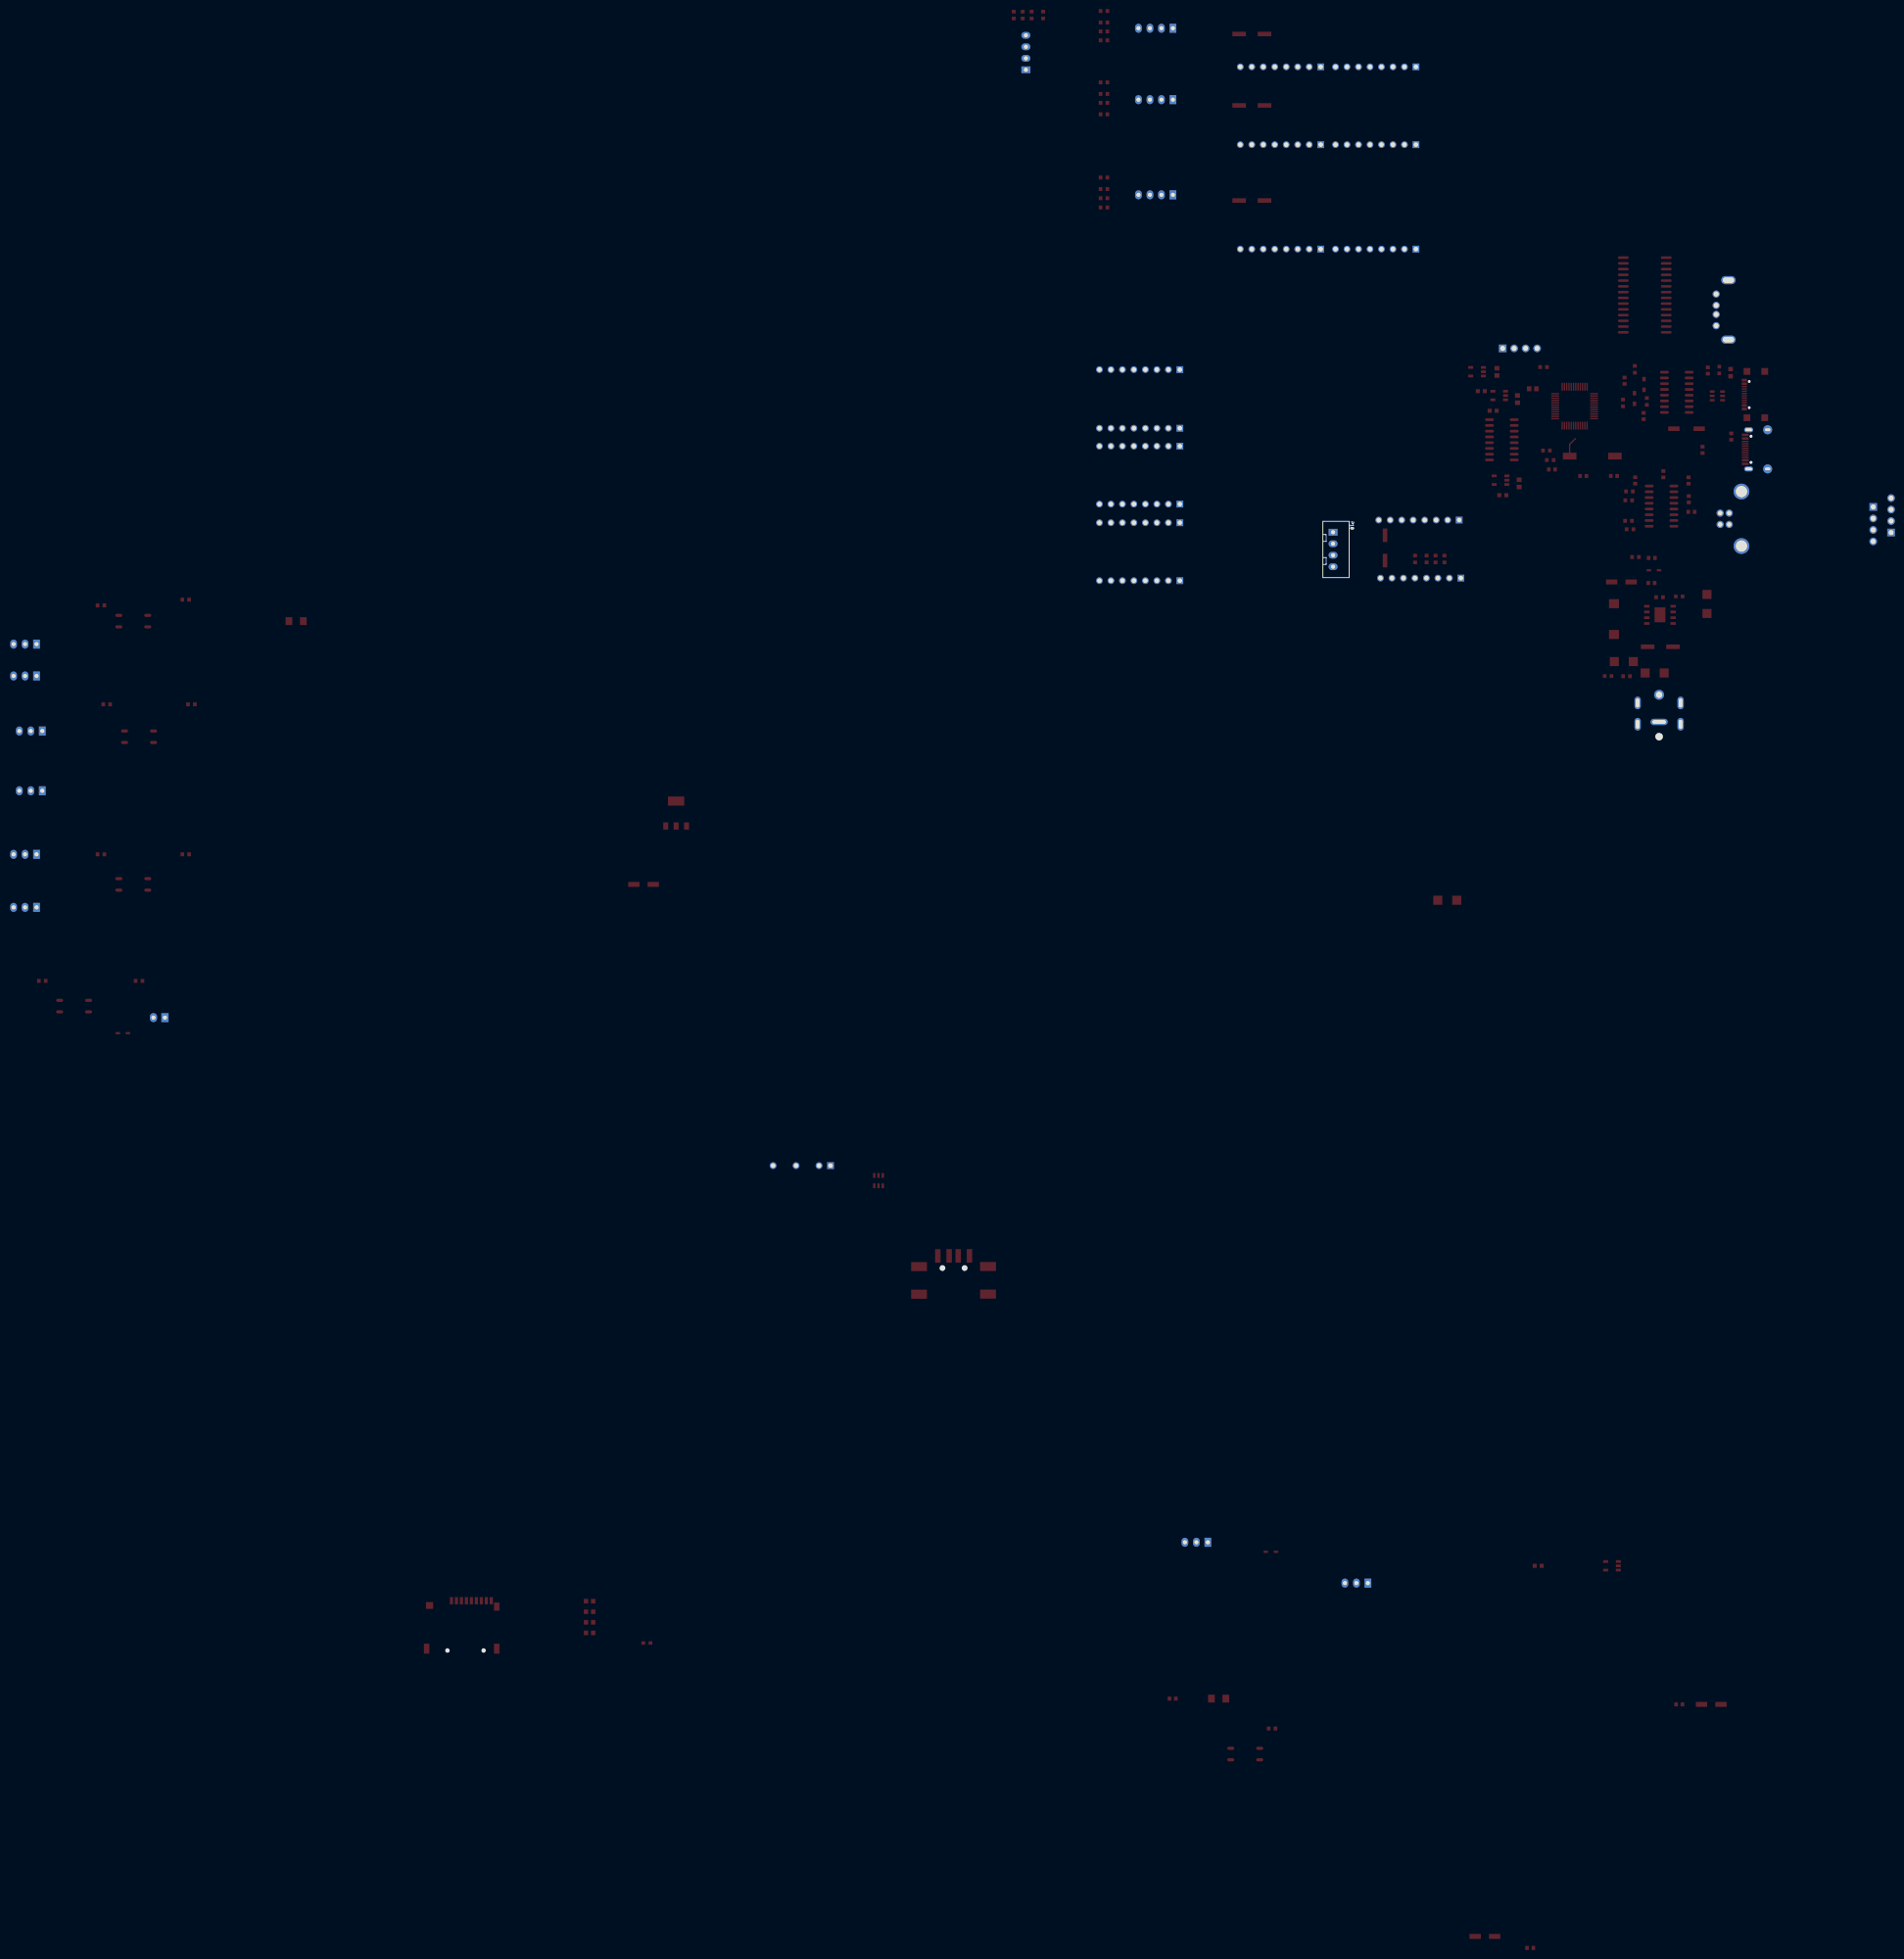
[diagram p2: board, bottom side, seen from below]

Outline 289.04 x 281.23 mm; copper layers: Top Layer, Bottom Layer. Coordinates in mm from the lower left corner of the outline.
Stack: Top Layer 0.035mm / Dielectric1 1.51mm FR4 er 4.5 / Bottom Layer 0.035mm

## Design rules (mm)
net SL_D-: DP3
net SL_D+: DP3
template: 用户自定义配置
spacing Default (default): track to track 0.152, other pairs 0 to 0.152
track width Default (default): min 0.254, default 0.254, max 25.4
differential pair differentialPair (default): width min 0.127, default 0.254, max 2.54; gap min 0.152, default 0.152
via Default (default): diameter min 0.25, default 0.61, max 100.025; hole min 0.2, default 0.305, max 59.995

## Placement (name value [footprint] x y rotation side)
C1  100uF/35V  [电解电容贴片6X6]  20.39 222.29 180 top
C2  4.7uF  [C1206]  118.05 -10.14 0 top
C3  104  [C0603]  128.21 -10.14 0 top
C7  100uF/10V  [CAP-SMD_BD5.0-L5.3-W5.3-RD]  28.99 236.61 0 top
C8  100uF/10V  [CAP-SMD_BD5.0-L5.3-W5.3-RD]  245.18 169.78 0 top
C19  100uF/35V  [电解电容贴片6X6]  81.26 244.13 90 top
C27  104  [11]  245.18 1.85 0 top
C32  100uF/35V  [电解电容贴片6X6]  110.7 357.69 0 top
C34  100uF/35V(47uF/50V)  [电解电容贴片6X6]  110.7 341.92 0 top
C35  104  [0603C]  47.39 19.21 0 top
C36  33pF  [C0603]  11.06 265.8 270 top
C38  0.1uF  [C0603]  22.28 241.92 0 top
C39  0.1uF  [C0603]  22.35 236.39 0 top
C40  100uF/35V  [电解电容贴片6X6]  110.7 320.89 0 top
C41  104  [0603C]  57.35 274.45 0 top
C42  104  [0603C]  55.22 255.78 180 top
C43  0.1uF  [C0603]  49.16 -65.22 0 top
C44  100uF/10V  [CAP-SMD_BD5.0-L5.3-W5.3-RD]  59.18 -62.68 0 top
C47  0.1uF  [C0603]  16.21 -11.41 0 top
C51  100uF/10V  [CAP-SMD_BD5.0-L5.3-W5.3-RD]  9.14 -11.41 0 top
C52  0.1uF  [C0603]  14.16 259.03 270 top
C54  0.1uF  [C0603]  28.3 281.08 270 top
C55  0.1uF  [C0603]  24.08 273.28 270 top
C56  33pF  [C0603]  9.89 283.33 270 top
C57  33pF  [C0603]  37.43 260.02 0 top
C58  33pF  [C0603]  30.64 260.03 0 top
C59  0.1uF  [C0603]  44.35 261.47 0 top
C61  4.7uF  [C1206]  321.99 227.96 0 top
C62  0.1uF  [C0603]  19.73 260.42 270 top
C63  0.1uF  [C0603]  14.1 254.89 270 top
C64  0.1uF  [C0603]  13.51 252.1 180 top
C65  0.1uF  [C0603]  25.96 259.04 270 top
C66  0.1uF  [C0603]  4.71 268.74 270 top
C67  104  [0603C]  59.97 278.78 180 top
D1  SS56  [SMA]  21.65 216.5 180 top
D4  PESD5V0L1BA-N  [SOD-323_L1.8-W1.3-LS2.5-BI]  21.8 239.19 0 top
D6  SS56  [SMA]  10.08 231.75 270 top
D7  USBLC6-2SC6  [SOT-23-6_L2.9-W1.6-P0.95-LS2.8-BL]  193.24 104.32 0 top
D8  1N4148  [SOD-323_L1.8-W1.3-LS2.5-RD]  26.1 277.15 270 top
D9  1N4148  [SOD-323_L1.8-W1.3-LS2.5-RD]  24 280.25 270 top
D24  USBLC6-2SC6  [SOT-23-6_L2.9-W1.6-P0.95-LS2.8-BL]  7.78 277.73 270 top
D25  PESD5V0L1BA-N  [SOD-323_L1.8-W1.3-LS2.5-BI]  106.49 22.31 0 top
D26  PESD5V0L1BA-N  [SOD-323_L1.8-W1.3-LS2.5-BI]  360.3 136.91 0 top
D32  SS56  [SMA]  28.46 219.02 180 top
D33  SS56  [SMA]  67.5 166.28 0 top
DC1  DC007B-2.5  [DC-IN-TH_HX-DC007B-2.5]  20.66 208.43 90 top
H2  PZ254V-11-08P  [HDR-TH_8P-P2.54-V-M]  73.76 250.29 0 top
H2#2  -  [HDR-TH_8P-P2.54-V-M]  135.51 249.7 0 top
H3  PZ254V-11-08P  [HDR-TH_8P-P2.54-V-M]  73.38 237.46 0 top
H3#2  -  [HDR-TH_8P-P2.54-V-M]  135.51 236.9 0 top
H4  PZ254V-11-08P  [HDR-TH_8P-P2.54-V-M]  83.31 350.43 0 top
H4#2  -  [HDR-TH_8P-P2.54-V-M]  135.51 266.62 0 top
H5  PZ254V-11-08P  [HDR-TH_8P-P2.54-V-M]  104.37 350.43 0 top
H5#2  -  [HDR-TH_8P-P2.54-V-M]  135.51 253.82 0 top
H7  PZ254V-11-08P  [HDR-TH_8P-P2.54-V-M]  83.31 333.25 0 top
H7#2  -  [HDR-TH_8P-P2.54-V-M]  135.51 283.53 0 top
H8  PZ254V-11-08P  [HDR-TH_8P-P2.54-V-M]  104.37 333.25 0 top
H8#2  -  [HDR-TH_8P-P2.54-V-M]  135.51 270.58 0 top
H9  PZ254  [HDR-TH_4P-P2.54-V-M]  -30.63 251.34 90 top
H10  PZ254V-11-08P  [HDR-TH_8P-P2.54-V-M]  83.31 310.16 0 top
H11  PZ254V-11-08P  [HDR-TH_8P-P2.54-V-M]  104.37 310.16 0 top
H12  PZ254  [HDR-TH_4P-P2.54-V-M]  51.44 288.22 180 top
H13  PZ254  [HDR-TH_4P-P2.54-V-M]  -26.67 249.38 270 top
L1  68uH  [IND-SMD_L7.0-W7.0_SMDRI74-330MT]  30.64 228.41 270 top
LED2  绿光  [LED0603-RD]  16.22 233.41 0 top
LED3  绿光  [LED0603-RD]  31.95 215.83 0 top
LED5  绿光  [LED0603-RD]  7.36 283.45 270 top
P8  3P  [HDR1X3_CON]  381.92 222.88 0 top
P11  3P  [HDR1X3_CON]  380.65 203.68 0 top
P12  3P  [HDR1X3_CON]  380.65 190.47 0 top
P14  3P  [HDR1X3_CON]  381.92 176.42 0 top
P16  3P  [HDR1X3_CON]  381.92 164.7 0 top
P18  4P  [HDR1X4_CON]  92.74 247.6 270 bottom
P21  4P  [HDR1X4_CON]  128.15 358.96 0 top
P22  2P  [HDR1X2_CON]  352.26 140.35 0 top
P23  4P  [HDR1X4_CON]  128.15 343.19 0 top
P24  3P  [HDR1X3_CON]  122.96 24.42 0 top
P29  3P  [HDR1X3_CON]  87.59 15.4 0 top
P30  3P  [HDR1X3_CON]  381.92 215.84 0 top
P31  4P  [HDR1X4_CON]  128.15 322.16 0 top
P35  USB-B10-BRW  [USB-B-TH_USB-B10-BRW]  4.81 250.57 270 top
P36  4P  [HDR1X4_CON]  160.66 349.79 90 top
R12  10K  [0603R]  48.59 279.3 0 top
R21  47K  [10]  4.74 283.75 270 top
R24  10K  [0603R]  51.6 258.39 270 top
R25  10K  [0603R]  56.52 283.03 90 top
R27  10K  [10]  256.22 11.28 0 top
R28  10K  [10]  256.22 8.94 0 top
R29  10K  [10]  256.22 6.61 0 top
R30  10K  [10]  256.22 4.27 0 top
R58  20kΩ  [R0603]  25.89 242.12 0 top
R59  10kΩ  [R0603]  20.56 233.24 0 top
R60  100kΩ  [R0603]  27.87 215.79 0 top
R61  2k  [R0603]  74.61 241.69 270 top
R62  2k  [R0603]  72.07 241.69 270 top
R63  2k  [R0603]  70.09 241.69 270 top
R64  2k  [R0603]  68.12 241.69 270 top
R65  2k  [R0603]  143.39 362.77 0 top
R66  2k  [R0603]  143.39 360.23 0 top
R67  2k  [R0603]  143.39 358.26 0 top
R68  2k  [R0603]  143.39 356.29 0 top
R69  2k  [R0603]  143.39 347 0 top
R70  2k  [R0603]  143.39 344.46 0 top
R71  2k  [R0603]  143.39 342.48 0 top
R72  2k  [R0603]  143.39 339.94 0 top
R77  1K  [R0603]  356.73 148.47 0 top
R78  10K  [R0603]  378.11 148.47 0 top
R79  4.7K  [R0603]  365.14 176.42 0 top
R81  4.7K  [R0603]  363.87 209.56 0 top
R82  4.7K  [R0603]  365.14 231.43 0 top
R83  47K  [R0603]  346.4 176.42 0 top
R84  47K  [R0603]  345.13 209.56 0 top
R85  47K  [R0603]  346.4 232.7 0 top
R86  2k  [R0603]  143.39 325.97 0 top
R87  2k  [R0603]  143.39 323.43 0 top
R88  2k  [R0603]  143.39 321.41 0 top
R89  2k  [R0603]  143.39 319.37 0 top
R90  0Ω  [R0603]  26.02 283.6 270 top
R91  10K  [R0603]  28.64 276.16 270 top
R92  10K  [R0603]  23.38 276.5 270 top
R96  10K  [R0603]  44.74 263.54 0 top
R97  10K  [R0603]  45.57 265.65 0 top
R98  10K  [R0603]  46.2 284.09 0 top
R100  47K  [R0603]  106.24 -16.74 0 top
R101  0Ω  [R0603]  27.09 248.25 0 top
R102  0Ω  [R0603]  27.43 250.12 0 top
R103  0Ω  [R0603]  27.39 254.65 0 top
R104  0Ω  [R0603]  27.23 256.62 0 top
R105  10K  [0603R]  51.97 277.02 270 top
R106  2k  [R0603]  156.85 361.88 90 top
R107  2k  [R0603]  159.39 361.88 90 top
R108  2k  [R0603]  161.36 361.88 90 top
R109  2k  [R0603]  163.33 361.88 90 top
U1  XL1509-5.0E1  [ESOP-8_L4.9-W3.9-P1.27-LS6.0-BL-EP]  20.47 229.35 90 top
U2  1117-3.3  [SOT-223]  237.98 185.39 0 top
U3  LTV-357T-C  [SOP-4_L4.4-W3.9-P2.54-LS7.0-TL]  358 227.96 0 top
U5  GD32F303CCT6  [LQFP48]  39.34 275.45 90 top
U7  SP3232EEN-L/TR  [SOIC-16_L9.9-W3.9-P1.27-LS6.0-BL]  20.13 253.37 270 top
U8  自弹TF卡座TFAA  [SIM-SMD_C9900015645]  285.39 6.2 0 top
U10  LTV-357T-C  [SOP-4_L4.4-W3.9-P2.54-LS7.0-TL]  358 169.78 0 top
U18  LTV-357T-C  [SOP-4_L4.4-W3.9-P2.54-LS7.0-TL]  371.08 142.89 0 top
U20  74LVC1G17  [SOT-23-5]  31.08 19.21 0 top
U21  LTV-357T-C  [SOP-4_L4.4-W3.9-P2.54-LS7.0-TL]  356.73 202.41 0 top
U23  CA-IS3760  [SOIC-16_L9.9-W3.9-P1.27-LS6.0-BL]  55.43 268.02 270 top
U24  74LVC1G17  [SOT-23-5]  60.91 283.07 0 top
U25  74LVC1G17  [SOT-23-5]  55.72 259.11 0 top
U26  CH340G  [SOIC-16_L9.9-W3.9-P1.27-LS6.0-BL]  16.75 278.52 270 top
U27  CH376S  [SOIC-28_L17.9-W7.5-P1.27-LS10.3-BL]  23.84 300.02 270 top
U29  B0505LS-1WR3  [PWRM-TH_BXXXXLS-1WR3]  210.2 107.64 0 top
U30  LTV-357T-C  [SOP-4_L4.4-W3.9-P2.54-LS7.0-TL]  112.17 -22.39 0 top
U31  74LVC1G17  [SOT-23-5]  56.02 277.81 0 top
USB1  U-USBAR04P-F002  [USB-A-TH_USB-302-T]  6.69 296.73 270 top
USB2  TYPE-C 16PIN  [USB-C-SMD_TYPE-C-6PIN+]  -0.96 265.91 270 top
USB7  AF 10.0 QT-ZB6.8  [USB-A-SMD_AF-10.0-QT-ZB6.8]  176.65 83.47 0 top
USB8  TYPE-C 16PIN(MC-107SSY)  [USB-TYPE-C-SMD_MC-107SSY]  -0.44 278.02 270 top
Y1  12M  [晶振贴片49SSMD]  14.61 270.47 0 top
Y2  8M  [晶振贴片]  35.44 264.42 0 top

## Footprints (pads in the part's own frame, mm; a bottom-side part is the same pattern mirrored in y, then rotated)
10
  rect 0.965x1.016 smd: 1(0.101,0.117) 2(1.688,0.117)
11
  rect 0.813x0.762 smd: 1(0.043,0.296) 2(-1.524,0.301)
0603C
  rect 0.889x0.889 smd: 1(-0.774,0) 2(0.774,0)
0603R
  rect 1x1.1 smd: 1(-0.8,0) 2(0.8,0)
C0603
  rect 0.8x0.9 smd: 1(-0.7,0) 2(0.7,0)
C1206
  rect 1.485x1.728 smd: 1(-1.593,0) 2(1.593,0)
CAP-SMD_BD5.0-L5.3-W5.3-RD
  rect 2.5x1.1 smd: 1(2.15,0) 2(-2.15,0)
DC-IN-TH_HX-DC007B-2.5
  round 2.2 hole 1.4: 1(3.25,0)
  oval 1.4x3.8 hole 0.8x3: 2(-2.75,0)
  oval 2.8x1.4 hole 2x0.8: 3(-3.25,4.75) 3(-3.25,-4.75) 3(1.45,4.75) 3(1.45,-4.75)
ESOP-8_L4.9-W3.9-P1.27-LS6.0-BL-EP
  rect 0.6x1.2 smd: 1(-1.905,-2.909) 2(-0.635,-2.909) 3(0.635,-2.909) 4(1.905,-2.909) 5(1.905,2.909) 6(0.635,2.909) 7(-0.635,2.909) 8(-1.905,2.909)
  rect 3.3x2.4 smd: 9(0,0)
HDR1X2_CON
  rect 1.6x2 hole 0.9: 1(-1.27,0)
  oval 1.6x2 hole 0.9: 2(1.27,0)
HDR1X3_CON
  rect 1.5x2 hole 0.9: 1(-2.54,0)
  oval 1.5x2 hole 0.9: 2(0,0) 3(2.54,0)
HDR1X4_CON
  rect 1.5x2 hole 0.9: 1(0,0)
  oval 1.5x2 hole 0.9: 2(2.54,0) 3(5.08,0) 4(7.62,0)
HDR-TH_4P-P2.54-V-M
  rect 1.7x1.7 hole 1.1: 1(-3.81,0)
  round 1.7 hole 1.1: 2(-1.27,0) 3(1.27,0) 4(3.81,0)
HDR-TH_8P-P2.54-V-M
  rect 1.5x1.5 hole 1: 1(-8.89,0)
  round 1.5 hole 1: 2(-6.35,0) 3(-3.81,0) 4(-1.27,0) 5(1.27,0) 6(3.81,0) 7(6.35,0) 8(8.89,0)
IND-SMD_L7.0-W7.0_SMDRI74-330MT
  rect 2x2.2 smd: 1(-3.4,0) 2(3.4,0)
LED0603-RD
  rect 0.8x0.8 smd: 1(-0.749,0) 2(0.749,0)
LQFP48
  oval 1.8x0.3 smd: 1(-4.3,2.75) 2(-4.3,2.25) 3(-4.3,1.75) 4(-4.3,1.25) 5(-4.3,0.75) 6(-4.3,0.25) 7(-4.3,-0.25) 8(-4.3,-0.75) 9(-4.3,-1.25) 10(-4.3,-1.75) 11(-4.3,-2.25) 12(-4.3,-2.75) 25(4.3,-2.75) 26(4.3,-2.25) 27(4.3,-1.75) 28(4.3,-1.25) 29(4.3,-0.75) 30(4.3,-0.25) 31(4.3,0.25) 32(4.3,0.75) 33(4.3,1.25) 34(4.3,1.75) 35(4.3,2.25) 36(4.3,2.75)
  oval 0.3x1.8 smd: 13(-2.75,-4.3) 14(-2.25,-4.3) 15(-1.75,-4.3) 16(-1.25,-4.3) 17(-0.75,-4.3) 18(-0.25,-4.3) 19(0.25,-4.3) 20(0.75,-4.3) 21(1.25,-4.3) 22(1.75,-4.3) 23(2.25,-4.3) 24(2.75,-4.3) 37(2.75,4.3) 38(2.25,4.3) 39(1.75,4.3) 40(1.25,4.3) 41(0.75,4.3) 42(0.25,4.3) 43(-0.25,4.3) 44(-0.75,4.3) 45(-1.25,4.3) 46(-1.75,4.3) 47(-2.25,4.3) 48(-2.75,4.3)
PWRM-TH_BXXXXLS-1WR3
  rect 1.524x1.524 hole 1: 1(-6.35,0)
  round 1.524 hole 1: 2(-3.81,0) 4(1.27,0) 6(6.35,0)
R0603
  rect 0.806x0.864 smd: 1(-0.753,0) 2(0.753,0)
SIM-SMD_C9900015645
  rect 0.7x1.6 smd: 1(2.25,5.3) 2(1.15,5.3) 3(0.05,5.3) 4(-1.05,5.3) 5(-2.15,5.3) 6(-3.25,5.3) 7(-4.35,5.3) 8(-5.45,5.3) 9(-6.55,5.3)
  rect 1.2x1.8 smd: 10(-7.75,4)
  rect 1.6x1.5 smd: 11(7.1,4.25)
  rect 1.2x2.2 smd: 12(-7.75,-5.3) 13(7.75,-5.3)
SMA
  rect 2x2 smd: 1(2.1,0) 2(-2.1,0)
SOD-323_L1.8-W1.3-LS2.5-BI
  rect 0.986x0.49 smd: 1(-1.117,0) 2(1.117,0)
SOD-323_L1.8-W1.3-LS2.5-RD
  rect 1x0.75 smd: 1(-1.173,0) 2(1.173,0)
SOIC-16_L9.9-W3.9-P1.27-LS6.0-BL
  oval 0.602x1.971 smd: 1(-4.445,-2.736) 2(-3.175,-2.736) 3(-1.905,-2.736) 4(-0.635,-2.736) 5(0.635,-2.736) 6(1.905,-2.736) 7(3.175,-2.736) 8(4.445,-2.736) 9(4.445,2.736) 10(3.175,2.736) 11(1.905,2.736) 12(0.635,2.736) 13(-0.635,2.736) 14(-1.905,2.736) 15(-3.175,2.736) 16(-4.445,2.736)
SOIC-28_L17.9-W7.5-P1.27-LS10.3-BL
  oval 0.574x2.388 smd: 1(-8.255,-4.744) 2(-6.985,-4.744) 3(-5.715,-4.744) 4(-4.445,-4.744) 5(-3.175,-4.744) 6(-1.905,-4.744) 7(-0.635,-4.744) 8(0.635,-4.744) 9(1.905,-4.744) 10(3.175,-4.744) 11(4.445,-4.744) 12(5.715,-4.744) 13(6.985,-4.744) 14(8.255,-4.744) 15(8.255,4.744) 16(6.985,4.744) 17(5.715,4.744) 18(4.445,4.744) 19(3.175,4.744) 20(1.905,4.744) 21(0.635,4.744) 22(-0.635,4.744) 23(-1.905,4.744) 24(-3.175,4.744) 25(-4.445,4.744) 26(-5.715,4.744) 27(-6.985,4.744) 28(-8.255,4.744)
SOP-4_L4.4-W3.9-P2.54-LS7.0-TL
  oval 1.55x0.7 smd: 1(-3.2,1.27) 2(-3.2,-1.27) 3(3.2,-1.27) 4(3.2,1.27)
SOT-23-5
  rect 1.1x0.6 smd: 1(-1.4,0.95) 2(-1.4,0) 3(-1.4,-0.95) 4(1.4,-0.95) 5(1.4,0.95)
SOT-23-6_L2.9-W1.6-P0.95-LS2.8-BL
  rect 0.532x1.072 smd: 1(-0.95,-1.149) 2(0,-1.149) 3(0.95,-1.149) 4(0.95,1.149) 5(0,1.149) 6(-0.95,1.149)
SOT-223
  rect 1.1x1.6 smd: 1(-2.3,-2.7) 2(0,-2.7) 3(2.3,-2.7)
  rect 3.6x2 smd: 4(0,2.8)
USB-A-SMD_AF-10.0-QT-ZB6.8
  rect 1.2x3 smd: 1(-3.528,4.237) 2(-1.028,4.237) 3(0.972,4.237) 4(3.472,4.213)
  rect 3.5x2 smd: 5(-7.628,-4.213) 5(-7.622,1.887) 5(7.628,1.863) 5(7.628,-4.237)
USB-A-TH_USB-302-T
  round 1.6 hole 1.1: 1(-3.5,1.355) 2(-1,1.355) 3(1,1.355) 4(3.5,1.355)
  oval 1.8x3.2 hole 1.2x2.5: 5(-6.57,-1.355) 6(6.57,-1.355)
USB-B-TH_USB-B10-BRW
  round 1.6 hole 1: 1(1.25,2.355) 2(-1.25,2.355) 3(-1.25,0.355) 4(1.25,0.355)
  round 3.5 hole 2.5: 5(-6.02,-2.355) 6(6.02,-2.355)
USB-C-SMD_TYPE-C-6PIN+
  rect 0.55x1.5 smd: 1(-3.2,2.575) 2(-2.4,2.575) 11(2.4,2.575) 12(3.2,2.575)
  rect 0.3x1.5 smd: 3(-1.75,2.575) 4(-1.25,2.575) 5(-0.75,2.575) 6(-0.25,2.575) 7(0.25,2.575) 8(0.75,2.575) 9(1.25,2.575) 10(1.75,2.575)
  oval 1.1x2 hole 0.6x1.5: 13(-4.325,1.825) 14(4.325,1.825)
  oval 2x2 hole 0.6x1.2: 13(-4.325,-2.375) 14(4.325,-2.375)
USB-TYPE-C-SMD_MC-107SSY
  rect 1.5x1.5 smd: 1(-5.12,1.677) 2(5.12,1.677) 3(-5.12,-2.252) 4(5.12,-2.252)
  rect 0.6x1.15 smd: A1B12(-3.2,2.252) A4B9(-2.4,2.252) B1A12(3.2,2.252) B4A9(2.4,2.252)
  rect 0.3x1.15 smd: A5(-1.25,2.252) A6(-0.25,2.252) A7(0.25,2.252) A8(1.25,2.252) B5(1.75,2.252) B6(0.75,2.252) B7(-0.75,2.252) B8(-1.75,2.252)
晶振贴片
  rect 3x1.5 smd: 1(-5,0) 2(5,0)
晶振贴片49SSMD
  rect 2.5x1 smd: 1(-2.8,0) 2(2.8,0)
电解电容贴片6X6
  rect 3x1 smd: 1(-2.8,0) 2(2.8,0)

## Nets
As in the schematic, except:
5V_2: H2.5 H2.6 H2.7 H2#2.5 H2#2.6 H2#2.7 H3.2 H3#2.2 H4.5 H4.6 H4.7 H4#2.5 H4#2.6 H4#2.7 H5.2 H5#2.2 H7.5 H7.6 H7.7 H7#2.5 H7#2.6 H7#2.7 H8.2 H8#2.2 H10.5 H10.6 H10.7 H11.2
12V_DIV: H3#2.8 H5#2.8 H8#2.8
GND: C1.2 C7.2 C8.2 C19.2 C27.1 C32.2 C34.2 C35.1 C36.1 C38.2 C39.1 C40.2 C41.1 C42.1 C43.1 C47.1 C51.2 C52.1 C54.2 C55.2 C56.1 C57.1 C58.1 C59.1 C64.2 C65.1 C67.1 D4.1 D7.2 D24.2 D25.1 D26.1 D32.1 DC1.2 DC1.3 H3.1 H3.7 H3#2.1 H3#2.7 H5.1 H5.7 H5#2.1 H5#2.7 H8.1 H8.7 H8#2.1 H8#2.7 H11.1 H11.7 H12.1 H13.4 LED2.1 LED3.1 LED5.1 P8.3 P11.3 P12.3 P14.3 P16.3 P22.2 P24.3 P29.3 P30.3 P35.4 P35.5 P35.6 R24.2 R25.2 R59.1 R61.1 R62.1 R63.1 R64.1 R65.1 R66.1 R67.1 R68.1 R69.1 R70.1 R71.1 R72.1 R86.1 R87.1 R88.1 R89.1 R96.2 R97.2 R105.2 R106.1 R107.1 R108.1 R109.1 U1.5 U1.6 U1.7 U1.8 U2.1 U3.3 U5.8 U5.23 U5.35 U5.47 U7.15 U8.6 U8.10 U8.11 U8.12 U8.13 U10.3 U18.3 U20.3 U21.3 U23.8 U23.9 U24.3 U25.3 U26.1 U30.2 U31.3 USB1.4 USB1.5 USB1.6 USB2.1 USB2.12 USB2.13 USB2.14 USB7.4 USB7.5
2_EN_O: H2.8 H2#2.8 H4.8 H4#2.8 H7.8 H7#2.8 H10.8
A_1A: H3#2.4 H11.4 P31.3 R88.2
A_1B: H3#2.3 H11.3 P31.4 R89.2
A_2A: H3#2.5 H11.5 P31.2 R87.2
A_2B: H3#2.6 H11.6 P31.1 R86.2
A_DIR_O: H2#2.1 H10.1 U31.4
A_STEP_O: H2#2.2 H10.2 U23.15
$9N177844: H2#2.3 H2#2.4
$9N190158: H4#2.3 H4#2.4
$9N190589: H7#2.3 H7#2.4
$9N305570: H2.3 H2.4
$9N305962: H4.3 H4.4
$9N306354: H7.3 H7.4

Pads without a net: C44 1 2; P29 2; R12 1 2; U1 9; U5 1; U8 1 8; U20 1; U24 1; U25 1; U26 9 10 11 12 14 15; U27 1 2 3 4 5 6 7 8 9 10 11 12 13 14 15 16 17 19 23 24 25 26 27 28; U30 3 4; U31 1; USB2 3 9; USB8 1 2 3 4 A1B12 A4B9 A5 A8 B1A12 B4A9 B5 B8

## Routing (per net, layer and track width the routed paths; a pad name or vN(x,y) marks a point on that pad's centre or on a via; arc(x,y) is an arc through that point)
XTAL2: length 4.5
  Top Layer w0.3: 40.44,264.34 40.44,267.01 39.16,268.3
